# Altium project Temp_sense_Project 2.0.PrjPcb
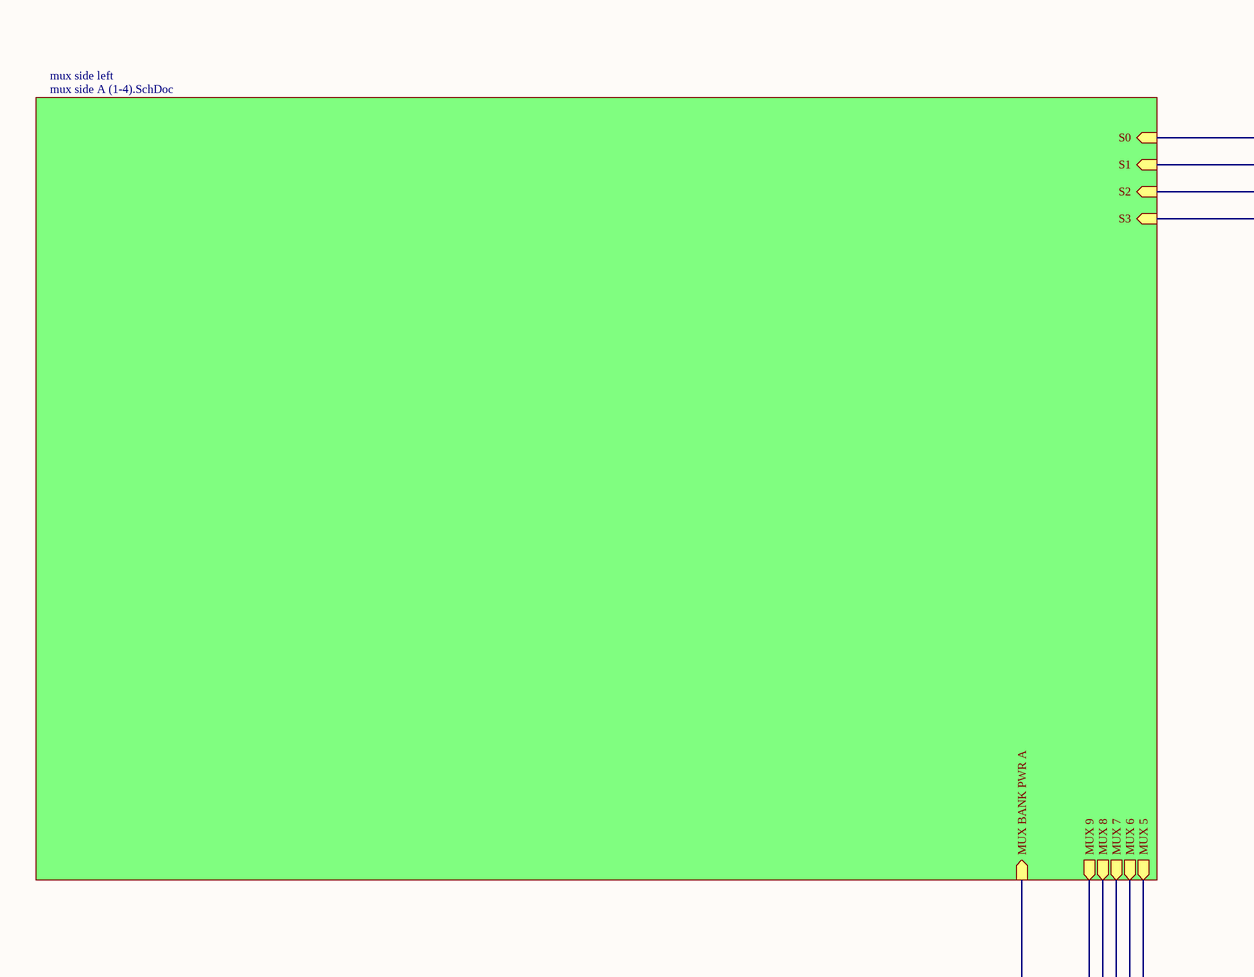
[diagram p0: temp sense 2.0 top.SchDoc, top left]
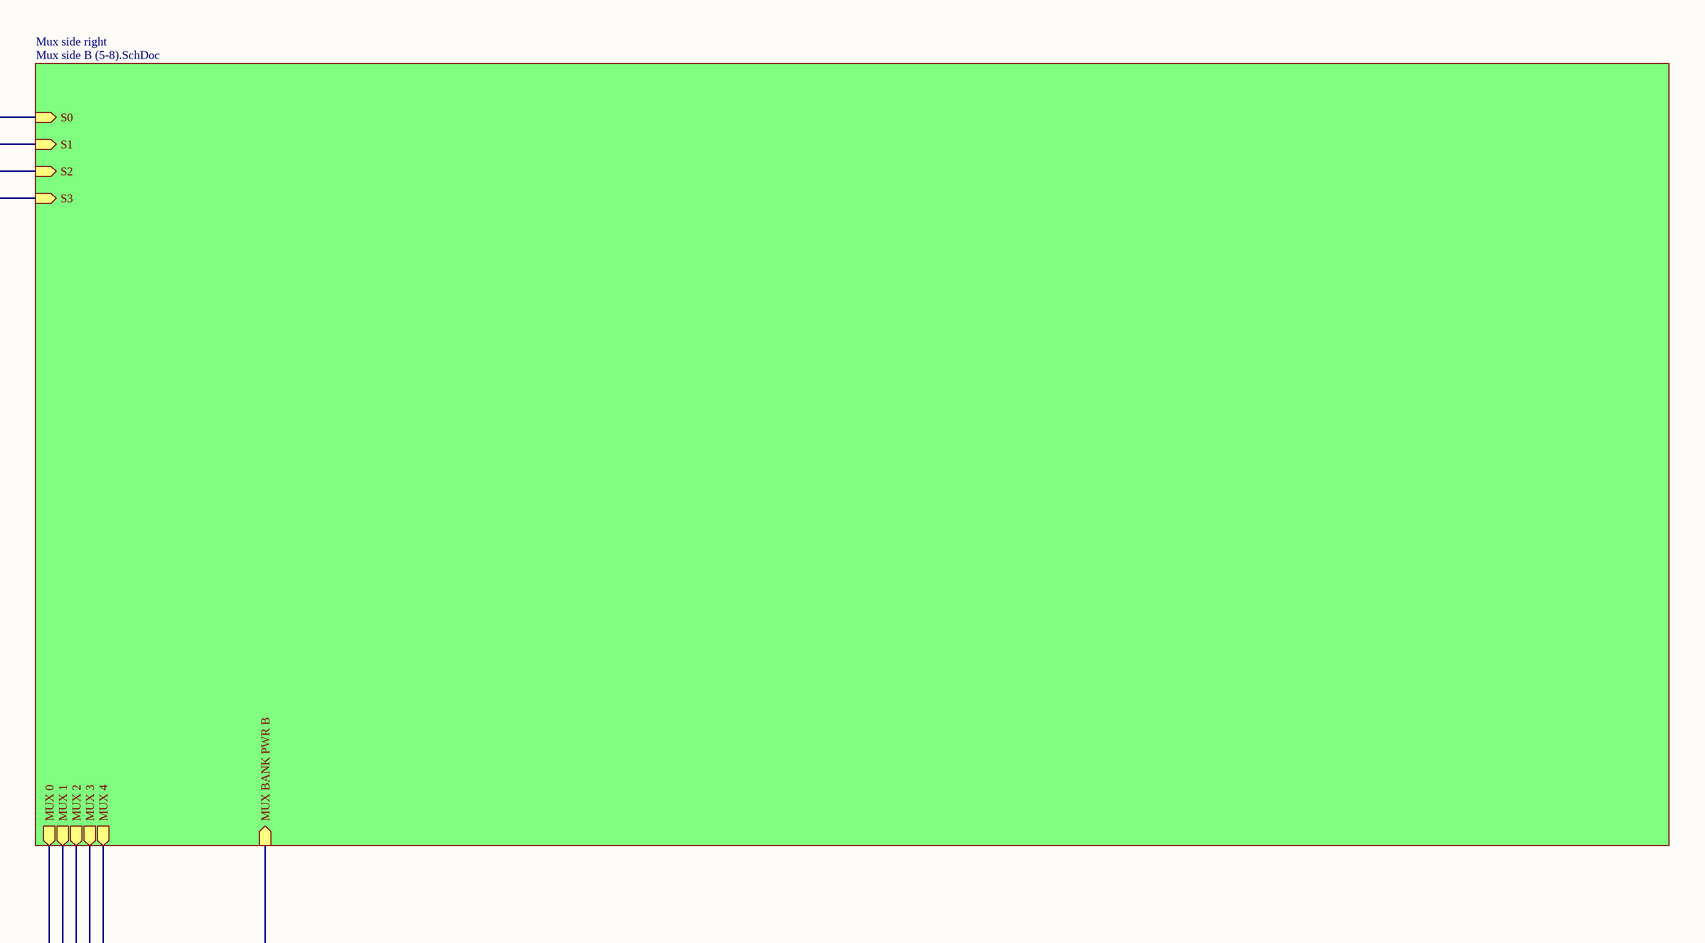
[diagram p1: temp sense 2.0 top.SchDoc, top right]
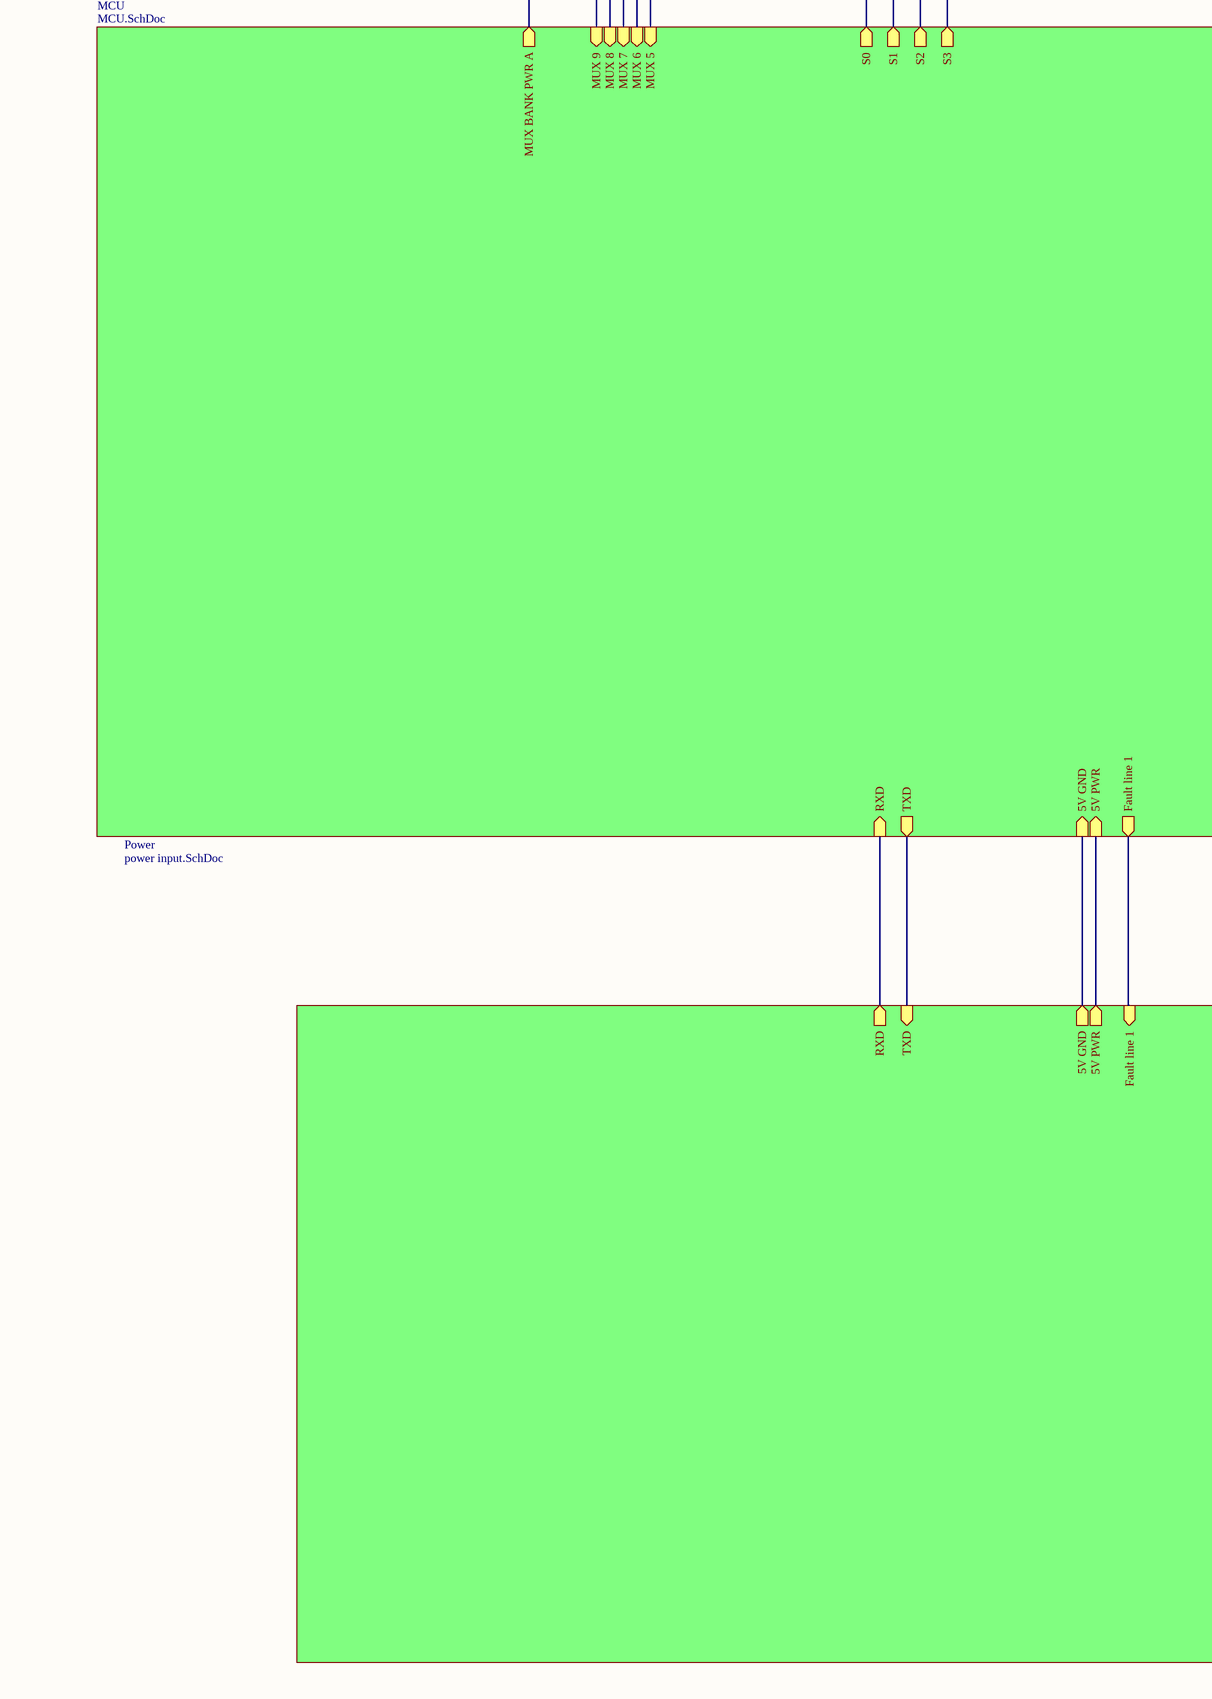
[diagram p2: temp sense 2.0 top.SchDoc, bottom left]
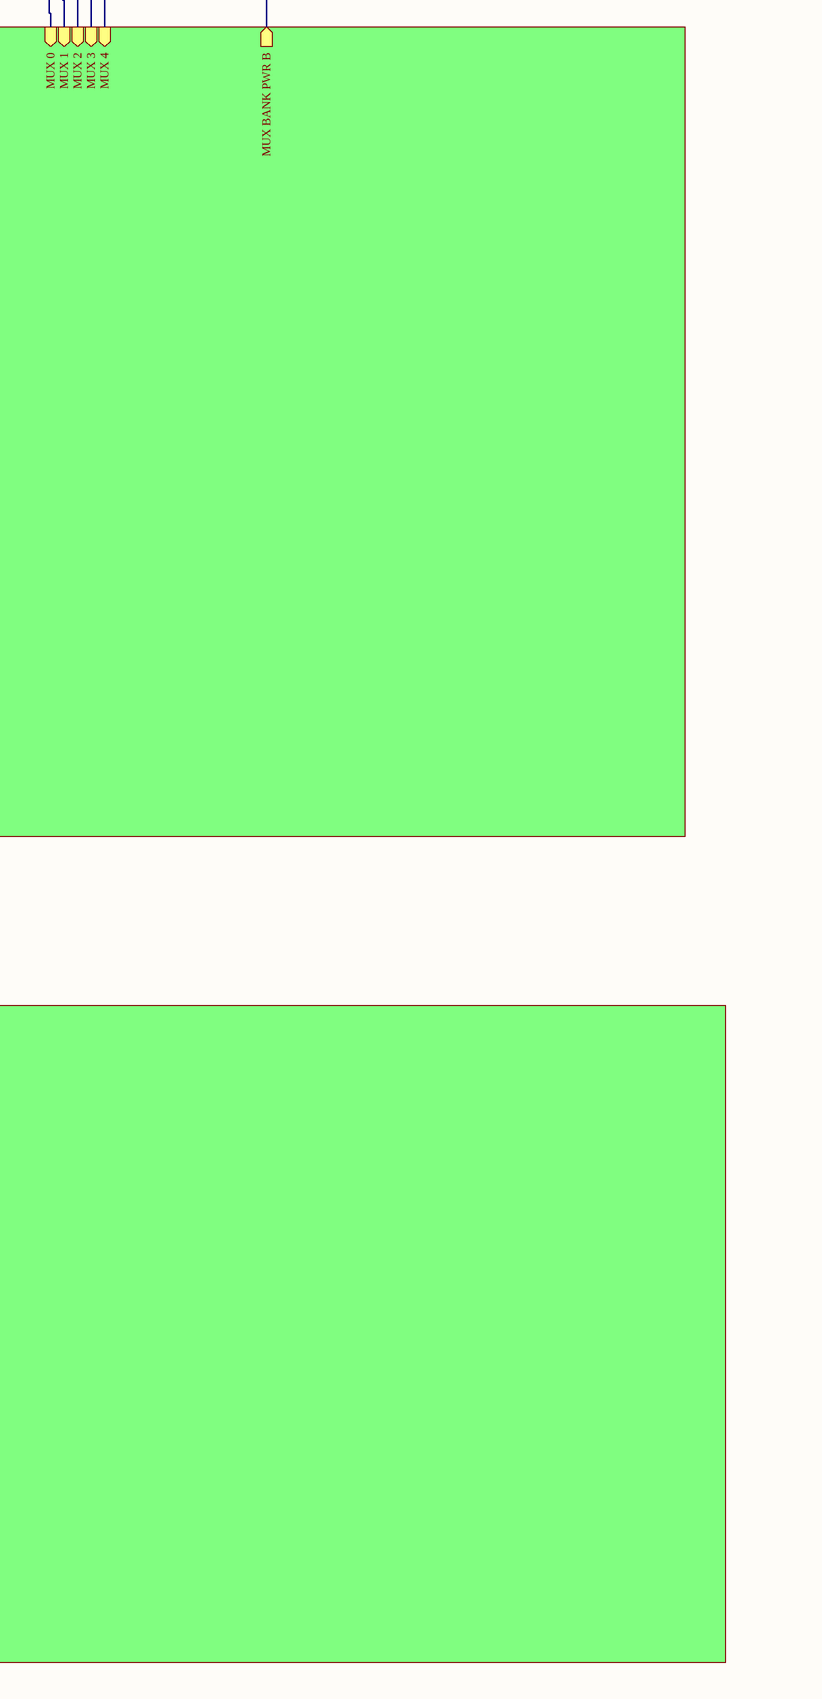
[diagram p3: temp sense 2.0 top.SchDoc, bottom right]
4 sheets, 162 parts. Net scope: hierarchical (ports join the sheet entries above them; power ports are global).
Board files: Temp_sense_Project 2.0(right angle.PcbDoc, temp sense 2.0,uhh.PcbDoc
Sheets:
  temp sense 2.0 top.SchDoc
    Mux side right = Mux side B (5-8).SchDoc
    mux side left = mux side A (1-4).SchDoc
    Power = power input.SchDoc

## Sheet temp sense 2.0 top.SchDoc: 2026 Temp Sense blocks
size 863 x 558 mm; Date: 11/29/2025; Author: Mitchell Donahue; CompanyName: Lawrence Technological University; DrawnBy: Mitchell Donahue; Engineer: Mitchell Donahue; Organization: Blue Devil Motorsport; DocumentNumber: 1; Revision: 1; SheetNumber: 1; SheetTotal: 5; =Project: Temp sense; Application_BuildNumber: 1

### Sub-sheets
MCU = MCU.SchDoc (file not in this document): S0 (out), S1 (out), S2 (out), S3 (out), MUX 0 (in), MUX 1 (in), MUX 2 (in), MUX 3 (in), MUX 4 (in), MUX 5 (in), MUX 6 (in), MUX 7 (in), MUX 8 (in), MUX 9 (in), 5V GND (in), 5V PWR (in), MUX BANK PWR A (out), MUX BANK PWR B (out), TXD (out), RXD (in), Fault line 1 (out)
mux side left = mux side A (1-4).SchDoc: S0 (in), S1 (in), S2 (in), S3 (in), MUX 5 (out), MUX 6 (out), MUX 7 (out), MUX 8 (out), MUX 9 (out), MUX BANK PWR A (in)
Mux side right = Mux side B (5-8).SchDoc: S0 (in), S1 (in), S2 (in), S3 (in), MUX 0 (out), MUX 1 (out), MUX 2 (out), MUX 3 (out), MUX 4 (out), MUX BANK PWR B (in)
Power = power input.SchDoc: 5V GND (out), 5V PWR (out), RXD (out), TXD (in), Fault line 1 (in)

### Nets
GND: sheet Power/5V GND, sheet MCU/5V GND
NetC3_1: sheet mux side left/MUX 5, sheet MCU/MUX 5
NetC4_1: sheet mux side left/MUX 6, sheet MCU/MUX 6
NetC5_1: sheet mux side left/MUX 7, sheet MCU/MUX 7
NetC6_1: sheet mux side left/MUX 8, sheet MCU/MUX 8
NetC7_1: sheet mux side left/MUX 9, sheet MCU/MUX 9
NetC8_1: sheet Mux side right/MUX 0, sheet MCU/MUX 0
NetC9_1: sheet Mux side right/MUX 1, sheet MCU/MUX 1
NetC10_1: sheet Mux side right/MUX 2, sheet MCU/MUX 2
NetC11_1: sheet Mux side right/MUX 3, sheet MCU/MUX 3
NetC12_1: sheet Mux side right/MUX 4, sheet MCU/MUX 4
NetC22_2: sheet Power/5V PWR, sheet MCU/5V PWR
NetR1_1: sheet mux side left/MUX BANK PWR A, sheet MCU/MUX BANK PWR A
NetR61_1: sheet Mux side right/MUX BANK PWR B, sheet MCU/MUX BANK PWR B
NetU1_10: sheet Mux side right/S0, sheet mux side left/S0, sheet MCU/S0
NetU1_11: sheet Mux side right/S1, sheet mux side left/S1, sheet MCU/S1
NetU1_13: sheet Mux side right/S3, sheet mux side left/S3, sheet MCU/S3
NetU1_14: sheet Mux side right/S2, sheet mux side left/S2, sheet MCU/S2
NetU9_11: sheet Power/Fault line 1, sheet MCU/Fault line 1
NetU9_12: sheet Power/TXD, sheet MCU/TXD
NetU9_13: sheet Power/RXD, sheet MCU/RXD

### Notes on the sheet
- DWG. NO.
- REV.
- SHT.
- REVISION
- DESCRIPTION
- DATE
- APPROVED
- THIS DOCUMENT AND THE DATA DISCLOSED HEREIN OR HEREWITH IS THE PROPERTY OF ALTIUM LIMITED AND MAY BE FREELY DISTRIBUTED IN WHOLE. NO RIGHTS ARE RESERVED OR EXPRESS OR IMPLIED WARANTEE GIVEN.
- ENG:
- DSN:
- APPROVALS
- PROJECT
- DOCUMENT REVISION:
- DESIGN ITEM:
- CHK:
- BOM:
- REFERENCE DOCUMENTS
- PROJECT REVISION:
- TITLE
- FAB DWG:
- PCB DWG:
- ASSY DWG:
- SCALE:
- SIZE
- D
- CAGE CODE
- FILE NAME
- DWG NO.
- SHEET
- OF
- REV

## Sheet Mux side B (5-8).SchDoc
size A0; SheetNumber: 3; SheetTotal: 5
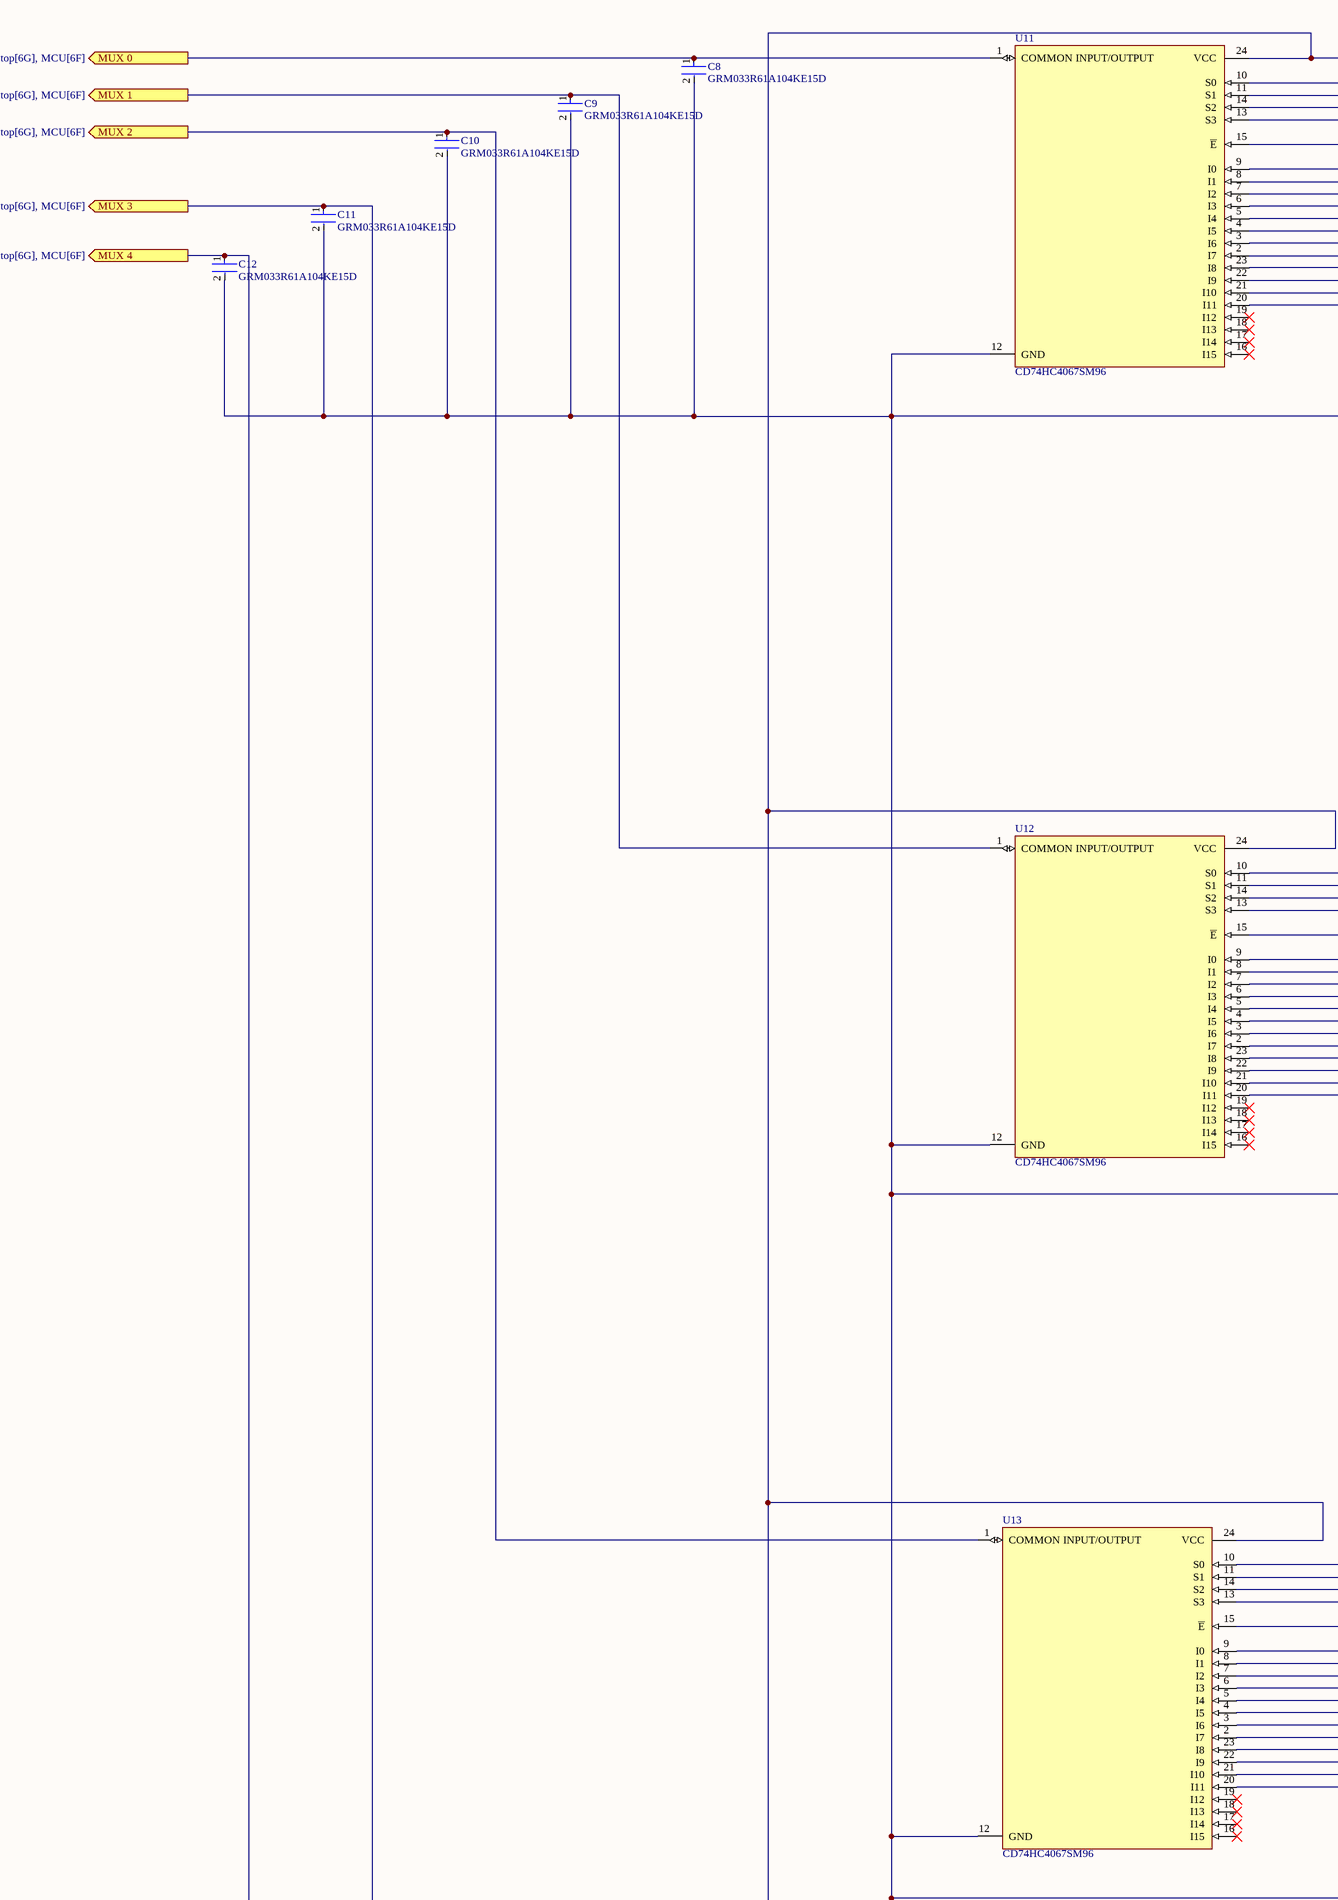
[diagram p4: Mux side B (5-8).SchDoc, top left]
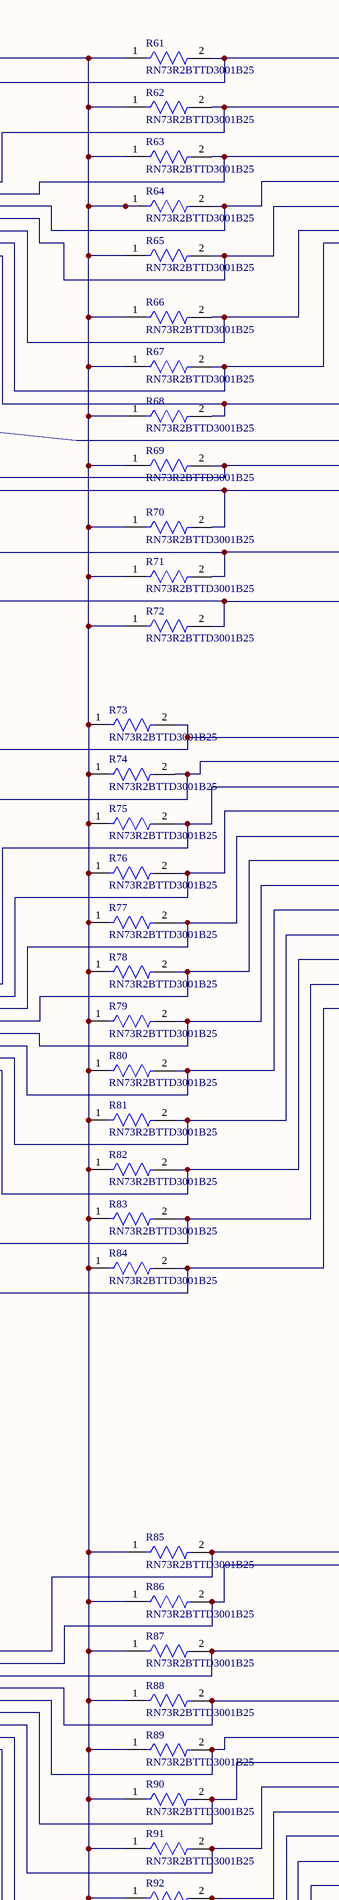
[diagram p5: Mux side B (5-8).SchDoc, top middle]
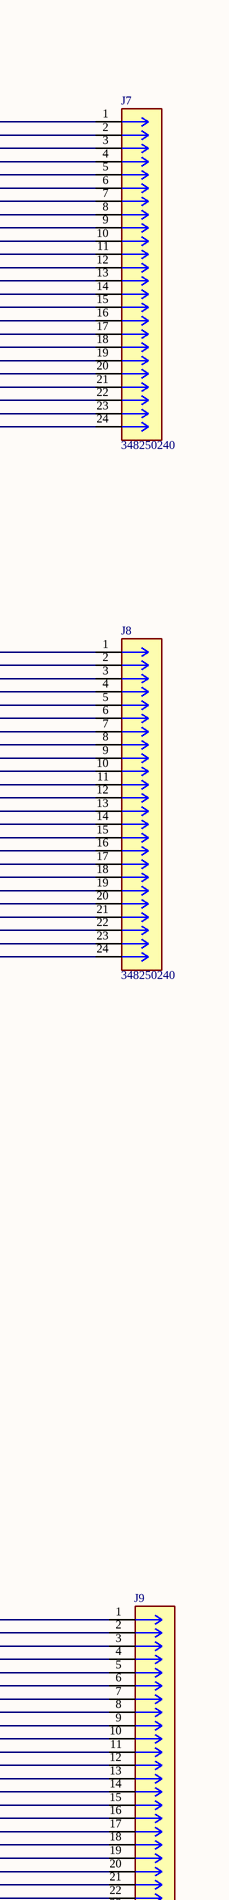
[diagram p6: Mux side B (5-8).SchDoc, top right]
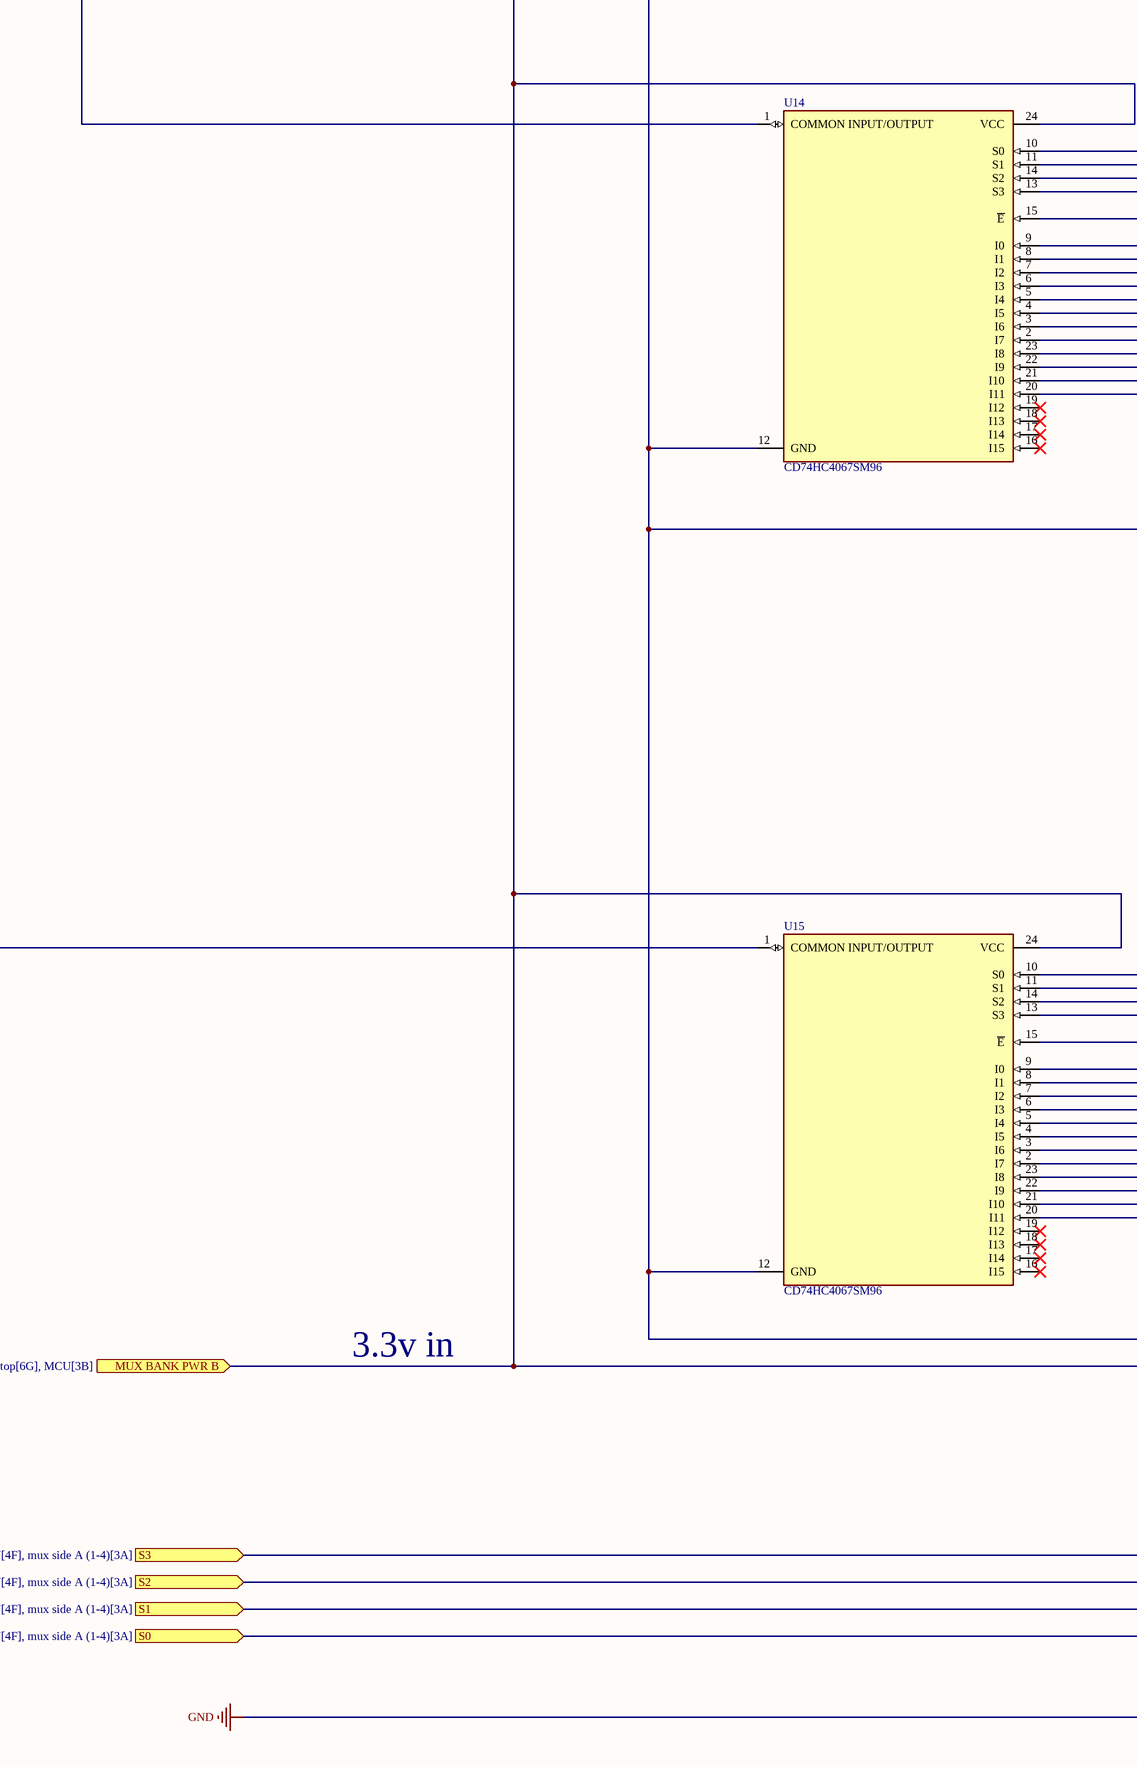
[diagram p7: Mux side B (5-8).SchDoc, bottom left]
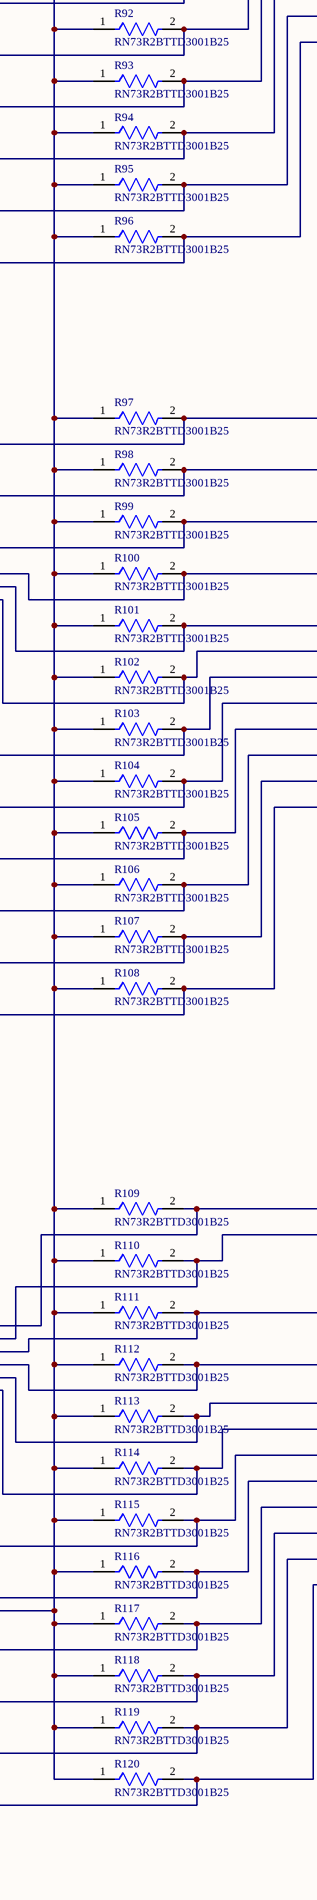
[diagram p8: Mux side B (5-8).SchDoc, bottom middle]
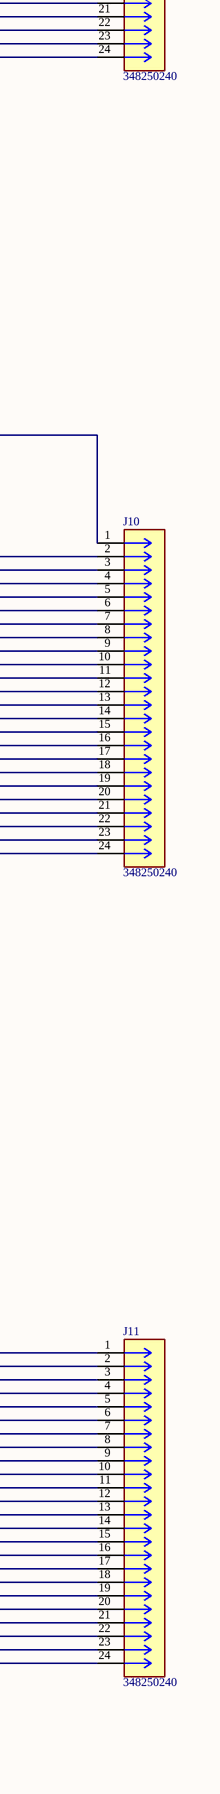
[diagram p9: Mux side B (5-8).SchDoc, bottom right]

### Parts
C8  GRM033R61A104KE15D  [FP-GRM033-0_03-IPC_C]
C9  GRM033R61A104KE15D  [FP-GRM033-0_03-IPC_C]
C10  GRM033R61A104KE15D  [FP-GRM033-0_03-IPC_C]
C11  GRM033R61A104KE15D  [FP-GRM033-0_03-IPC_C]
C12  GRM033R61A104KE15D  [FP-GRM033-0_03-IPC_C]
J7  348250240  [CONN_SD-34825-001_24_MOL]
J8  348250240  [CONN_SD-34825-001_24_MOL]
J9  348250240  [CONN_SD-34825-001_24_MOL]
J10  348250240  [CONN_SD-34825-001_24_MOL]
J11  348250240  [CONN_SD-34825-001_24_MOL]
R61  RN73R2BTTD3001B25  [FP-RN73R2B-IPC_A]
R62  RN73R2BTTD3001B25  [FP-RN73R2B-IPC_A]
R63  RN73R2BTTD3001B25  [FP-RN73R2B-IPC_A]
R64  RN73R2BTTD3001B25  [FP-RN73R2B-IPC_A]
R65  RN73R2BTTD3001B25  [FP-RN73R2B-IPC_A]
R66  RN73R2BTTD3001B25  [FP-RN73R2B-IPC_A]
R67  RN73R2BTTD3001B25  [FP-RN73R2B-IPC_A]
R68  RN73R2BTTD3001B25  [FP-RN73R2B-IPC_A]
R69  RN73R2BTTD3001B25  [FP-RN73R2B-IPC_A]
R70  RN73R2BTTD3001B25  [FP-RN73R2B-IPC_A]
R71  RN73R2BTTD3001B25  [FP-RN73R2B-IPC_A]
R72  RN73R2BTTD3001B25  [FP-RN73R2B-IPC_A]
R73  RN73R2BTTD3001B25  [FP-RN73R2B-IPC_A]
R74  RN73R2BTTD3001B25  [FP-RN73R2B-IPC_A]
R75  RN73R2BTTD3001B25  [FP-RN73R2B-IPC_A]
R76  RN73R2BTTD3001B25  [FP-RN73R2B-IPC_A]
R77  RN73R2BTTD3001B25  [FP-RN73R2B-IPC_A]
R78  RN73R2BTTD3001B25  [FP-RN73R2B-IPC_A]
R79  RN73R2BTTD3001B25  [FP-RN73R2B-IPC_A]
R80  RN73R2BTTD3001B25  [FP-RN73R2B-IPC_A]
R81  RN73R2BTTD3001B25  [FP-RN73R2B-IPC_A]
R82  RN73R2BTTD3001B25  [FP-RN73R2B-IPC_A]
R83  RN73R2BTTD3001B25  [FP-RN73R2B-IPC_A]
R84  RN73R2BTTD3001B25  [FP-RN73R2B-IPC_A]
R85  RN73R2BTTD3001B25  [FP-RN73R2B-IPC_A]
R86  RN73R2BTTD3001B25  [FP-RN73R2B-IPC_A]
R87  RN73R2BTTD3001B25  [FP-RN73R2B-IPC_A]
R88  RN73R2BTTD3001B25  [FP-RN73R2B-IPC_A]
R89  RN73R2BTTD3001B25  [FP-RN73R2B-IPC_A]
R90  RN73R2BTTD3001B25  [FP-RN73R2B-IPC_A]
R91  RN73R2BTTD3001B25  [FP-RN73R2B-IPC_A]
R92  RN73R2BTTD3001B25  [FP-RN73R2B-IPC_A]
R93  RN73R2BTTD3001B25  [FP-RN73R2B-IPC_A]
R94  RN73R2BTTD3001B25  [FP-RN73R2B-IPC_A]
R95  RN73R2BTTD3001B25  [FP-RN73R2B-IPC_A]
R96  RN73R2BTTD3001B25  [FP-RN73R2B-IPC_A]
R97  RN73R2BTTD3001B25  [FP-RN73R2B-IPC_A]
R98  RN73R2BTTD3001B25  [FP-RN73R2B-IPC_A]
R99  RN73R2BTTD3001B25  [FP-RN73R2B-IPC_A]
R100  RN73R2BTTD3001B25  [FP-RN73R2B-IPC_A]
R101  RN73R2BTTD3001B25  [FP-RN73R2B-IPC_A]
R102  RN73R2BTTD3001B25  [FP-RN73R2B-IPC_A]
R103  RN73R2BTTD3001B25  [FP-RN73R2B-IPC_A]
R104  RN73R2BTTD3001B25  [FP-RN73R2B-IPC_A]
R105  RN73R2BTTD3001B25  [FP-RN73R2B-IPC_A]
R106  RN73R2BTTD3001B25  [FP-RN73R2B-IPC_A]
R107  RN73R2BTTD3001B25  [FP-RN73R2B-IPC_A]
R108  RN73R2BTTD3001B25  [FP-RN73R2B-IPC_A]
R109  RN73R2BTTD3001B25  [FP-RN73R2B-IPC_A]
R110  RN73R2BTTD3001B25  [FP-RN73R2B-IPC_A]
R111  RN73R2BTTD3001B25  [FP-RN73R2B-IPC_A]
R112  RN73R2BTTD3001B25  [FP-RN73R2B-IPC_A]
R113  RN73R2BTTD3001B25  [FP-RN73R2B-IPC_A]
R114  RN73R2BTTD3001B25  [FP-RN73R2B-IPC_A]
R115  RN73R2BTTD3001B25  [FP-RN73R2B-IPC_A]
R116  RN73R2BTTD3001B25  [FP-RN73R2B-IPC_A]
R117  RN73R2BTTD3001B25  [FP-RN73R2B-IPC_A]
R118  RN73R2BTTD3001B25  [FP-RN73R2B-IPC_A]
R119  RN73R2BTTD3001B25  [FP-RN73R2B-IPC_A]
R120  RN73R2BTTD3001B25  [FP-RN73R2B-IPC_A]
U11  CD74HC4067SM96  [FP-DB0024A-IPC_C]
U12  CD74HC4067SM96  [FP-DB0024A-IPC_C]
U13  CD74HC4067SM96  [FP-DB0024A-IPC_C]
U14  CD74HC4067SM96  [FP-DB0024A-IPC_C]
U15  CD74HC4067SM96  [FP-DB0024A-IPC_C]

### Ports
MUX 0 (out, see temp sense 2.0 top[6G], MCU[6F]), MUX 1 (out, see temp sense 2.0 top[6G], MCU[6F]), MUX 2 (out, see temp sense 2.0 top[6G], MCU[6F]), MUX 3 (out, see temp sense 2.0 top[6G], MCU[6F]), MUX 4 (out, see temp sense 2.0 top[6G], MCU[6F]), MUX BANK PWR B (in, see temp sense 2.0 top[6G], MCU[3B]), S0 (in, see temp sense 2.0 top[6J], MCU[4F], mux side A (1-4)[3A]), S1 (in, see temp sense 2.0 top[6J], MCU[4F], mux side A (1-4)[3A]), S2 (in, see temp sense 2.0 top[6J], MCU[4F], mux side A (1-4)[3A]), S3 (in, see temp sense 2.0 top[6J], MCU[4F], mux side A (1-4)[3A])

### Nets
GND: C8.2 C9.2 C10.2 C11.2 C12.2 J7.2 J7.4 J7.6 J7.8 J7.10 J7.12 J7.14 J7.16 J7.18 J7.20 J7.22 J7.24 J8.2 J8.4 J8.6 J8.8 J8.10 J8.12 J8.14 J8.16 J8.18 J8.20 J8.22 J8.24 J9.2 J9.4 J9.6 J9.8 J9.10 J9.12 J9.14 J9.16 J9.18 J9.20 J9.22 J9.24 J10.2 J10.4 J10.6 J10.8 J10.10 J10.12 J10.14 J10.16 J10.18 J10.20 J10.22 J10.24 J11.2 J11.4 J11.6 J11.8 J11.10 J11.12 J11.14 J11.16 J11.18 J11.20 J11.22 J11.24 U11.12(GND) U11.15(~{E}) U12.12(GND) U12.15(~{E}) U13.12(GND) U13.15(~{E}) U14.12(GND) U14.15(~{E}) U15.12(GND) U15.15(~{E})
NetC8_1: C8.1 U11.1(COMMON_INPUT/OUTPUT) ; port MUX 0
NetC9_1: C9.1 U12.1(COMMON_INPUT/OUTPUT) ; port MUX 1
NetC10_1: C10.1 U13.1(COMMON_INPUT/OUTPUT) ; port MUX 2
NetC11_1: C11.1 U14.1(COMMON_INPUT/OUTPUT) ; port MUX 3
NetC12_1: C12.1 U15.1(COMMON_INPUT/OUTPUT) ; port MUX 4
NetJ7_1: J7.1 R61.2 U11.9(I0)
NetJ7_3: J7.3 R62.2 U11.8(I1)
NetJ7_5: J7.5 R63.2 U11.7(I2)
NetJ7_7: J7.7 R64.2 U11.6(I3)
NetJ7_9: J7.9 R65.2 U11.5(I4)
NetJ7_11: J7.11 R66.2 U11.4(I5)
NetJ7_13: J7.13 R67.2 U11.3(I6)
NetJ7_15: J7.15 R68.2 U11.2(I7)
NetJ7_17: J7.17 R69.2 U11.23(I8)
NetJ7_19: J7.19 R70.2 U11.22(I9)
NetJ7_21: J7.21 R71.2 U11.21(I10)
NetJ7_23: J7.23 R72.2 U11.20(I11)
NetJ8_1: J8.1 R73.2 U12.9(I0)
NetJ8_3: J8.3 R74.2 U12.8(I1)
NetJ8_5: J8.5 R75.2 U12.7(I2)
NetJ8_7: J8.7 R76.2 U12.6(I3)
NetJ8_9: J8.9 R77.2 U12.5(I4)
NetJ8_11: J8.11 R78.2 U12.4(I5)
NetJ8_13: J8.13 R79.2 U12.3(I6)
NetJ8_15: J8.15 R80.2 U12.2(I7)
NetJ8_17: J8.17 R81.2 U12.23(I8)
NetJ8_19: J8.19 R82.2 U12.22(I9)
NetJ8_21: J8.21 R83.2 U12.21(I10)
NetJ8_23: J8.23 R84.2 U12.20(I11)
NetJ9_1: J9.1 R85.2 U13.9(I0)
NetJ9_3: J9.3 R86.2 U13.8(I1)
NetJ9_5: J9.5 R87.2 U13.7(I2)
NetJ9_7: J9.7 R88.2 U13.6(I3)
NetJ9_9: J9.9 R89.2 U13.5(I4)
NetJ9_11: J9.11 R90.2 U13.4(I5)
NetJ9_13: J9.13 R91.2 U13.3(I6)
NetJ9_15: J9.15 R92.2 U13.2(I7)
NetJ9_17: J9.17 R93.2 U13.23(I8)
NetJ9_19: J9.19 R94.2 U13.22(I9)
NetJ9_21: J9.21 R95.2 U13.21(I10)
NetJ9_23: J9.23 R96.2 U13.20(I11)
NetJ10_1: J10.1 R97.2 U14.9(I0)
NetJ10_3: J10.3 R98.2 U14.8(I1)
NetJ10_5: J10.5 R99.2 U14.7(I2)
NetJ10_7: J10.7 R100.2 U14.6(I3)
NetJ10_9: J10.9 R101.2 U14.5(I4)
NetJ10_11: J10.11 R102.2 U14.4(I5)
NetJ10_13: J10.13 R103.2 U14.3(I6)
NetJ10_15: J10.15 R104.2 U14.2(I7)
NetJ10_17: J10.17 R105.2 U14.23(I8)
NetJ10_19: J10.19 R106.2 U14.22(I9)
NetJ10_21: J10.21 R107.2 U14.21(I10)
NetJ10_23: J10.23 R108.2 U14.20(I11)
NetJ11_1: J11.1 R109.2 U15.9(I0)
NetJ11_3: J11.3 R110.2 U15.8(I1)
NetJ11_5: J11.5 R111.2 U15.7(I2)
NetJ11_7: J11.7 R112.2 U15.6(I3)
NetJ11_9: J11.9 R113.2 U15.5(I4)
NetJ11_11: J11.11 R114.2 U15.4(I5)
NetJ11_13: J11.13 R115.2 U15.3(I6)
NetJ11_15: J11.15 R116.2 U15.2(I7)
NetJ11_17: J11.17 R117.2 U15.23(I8)
NetJ11_19: J11.19 R118.2 U15.22(I9)
NetJ11_21: J11.21 R119.2 U15.21(I10)
NetJ11_23: J11.23 R120.2 U15.20(I11)
NetR61_1: R61.1 R62.1 R63.1 R64.1 R65.1 R66.1 R67.1 R68.1 R69.1 R70.1 R71.1 R72.1 R73.1 R74.1 R75.1 R76.1 R77.1 R78.1 R79.1 R80.1 R81.1 R82.1 R83.1 R84.1 R85.1 R86.1 R87.1 R88.1 R89.1 R90.1 R91.1 R92.1 R93.1 R94.1 R95.1 R96.1 R97.1 R98.1 R99.1 R100.1 R101.1 R102.1 R103.1 R104.1 R105.1 R106.1 R107.1 R108.1 R109.1 R110.1 R111.1 R112.1 R113.1 R114.1 R115.1 R116.1 R117.1 R118.1 R119.1 R120.1 U11.24(VCC) U12.24(VCC) U13.24(VCC) U14.24(VCC) U15.24(VCC) ; port MUX BANK PWR B
NetU1_10: U11.10(S0) U12.10(S0) U13.10(S0) U14.10(S0) U15.10(S0) ; port S0
NetU1_11: U11.11(S1) U12.11(S1) U13.11(S1) U14.11(S1) U15.11(S1) ; port S1
NetU1_13: U11.13(S3) U12.13(S3) U13.13(S3) U14.13(S3) U15.13(S3) ; port S3
NetU1_14: U11.14(S2) U12.14(S2) U13.14(S2) U14.14(S2) U15.14(S2) ; port S2

Not connected (* = marked no-connect by the designer): U11 16(I15)* 17(I14)* 18(I13)* 19(I12)*; U12 16(I15)* 17(I14)* 18(I13)* 19(I12)*; U13 16(I15)* 17(I14)* 18(I13)* 19(I12)*; U14 16(I15)* 17(I14)* 18(I13)* 19(I12)*; U15 16(I15)* 17(I14)* 18(I13)* 19(I12)*

### Notes on the sheet
- 3.3v in

### Library data of the parts
C8-C12 = CMP-2010-01264-2: Chip Multilayer Ceramic Capacitors for General Purpose, 0201, 0.10uF, X5R, 15%, 10%, 10V; Capacitance: 100nF; Mount: Surface Mount; Dielectric: X5R; Width: 0.012inch; Tolerance: 10%; Radiation Hardening: No; Voltage Rating: 10V; REACH SVHC: No SVHC; Height: 0.3mm; Max Operating Temperature: 85°C; Voltage Rating (DC): 10V; Thickness: 0.013inch; Termination: SMD/SMT; Lead Free: Lead Free; Package Quantity: 1; Case/Package: 0201; Min Operating Temperature: -55°C; Weight: 6E-06oz; Length: 0.6mm; Case Code (Imperial): 0201; Depth: 0.3mm; Voltage: 10V; Packaging: Tape and Reel; Case Code (Metric): 0603
R61-R120 = CMP-04015-056270-1: 3kΩ ±0.1% 0.25W, 1/4W Chip Resistor 1206 (3216 Metric) Moisture Resistant Thin Film
U11-U15 = CMP-04892-000038-1: IC MUX/DEMUX 1X16 24SSOP; Supply Type: Single; High Level Output Current: 25mA; Min Supply Voltage: 2V; Number of Circuits: 16; Max Supply Voltage: 6V; Number of Channels: 1; Turn-On Delay Time: 300ns; Max Supply Current: 8uA; Bandwidth: 89MHz; Turn-Off Delay Time: 290ns; Propagation Delay: 75ns; Logic Function: Multiplexer; On-State Resistance: 160R; Polarity: Non-Inverting; Width: 5.3mm; Case/Package: SSOP; Max Operating Temperature: 125°C; Mount: Surface Mount; Min Operating Temperature: -55°C; REACH SVHC: No SVHC; Contact Plating: Gold; Max Output Current: 25mA; Weight: 0.006081oz; Height: 1.95mm; Package Quantity: 2000; Length: 8.2mm; Lead Free: Lead Free; Operating Supply Current: 8uA; Packaging: Tape and Reel; Series: 74HC; Low Level Output Current: 25mA; Number of Outputs: 1; Termination: SMD/SMT; Number of Inputs: 16; Number of Bits: 16; Radiation Hardening: No; Number of Pins: 24
J7-J11 = 348250240: Package: None; Price: None; Value: *; MP: 348250240; Availability: Unavailable
  J9: ComponentLink1Description: New link; ComponentLink1URL: *; ComponentLink2Description: New link 1; ComponentLink2URL: *

## Sheet mux side A (1-4).SchDoc
size E; SheetNumber: 2; SheetTotal: 4
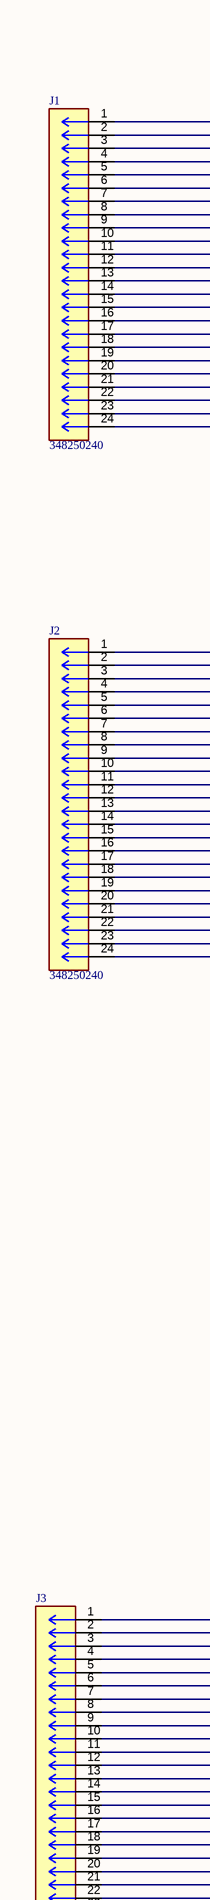
[diagram p10: mux side A (1-4).SchDoc, top left]
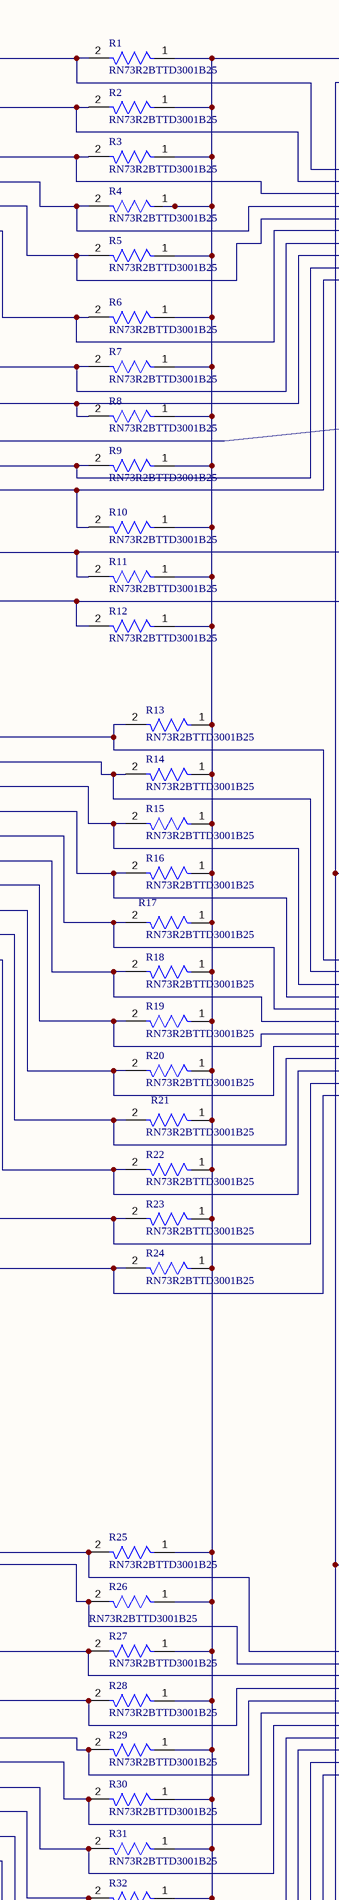
[diagram p11: mux side A (1-4).SchDoc, top middle]
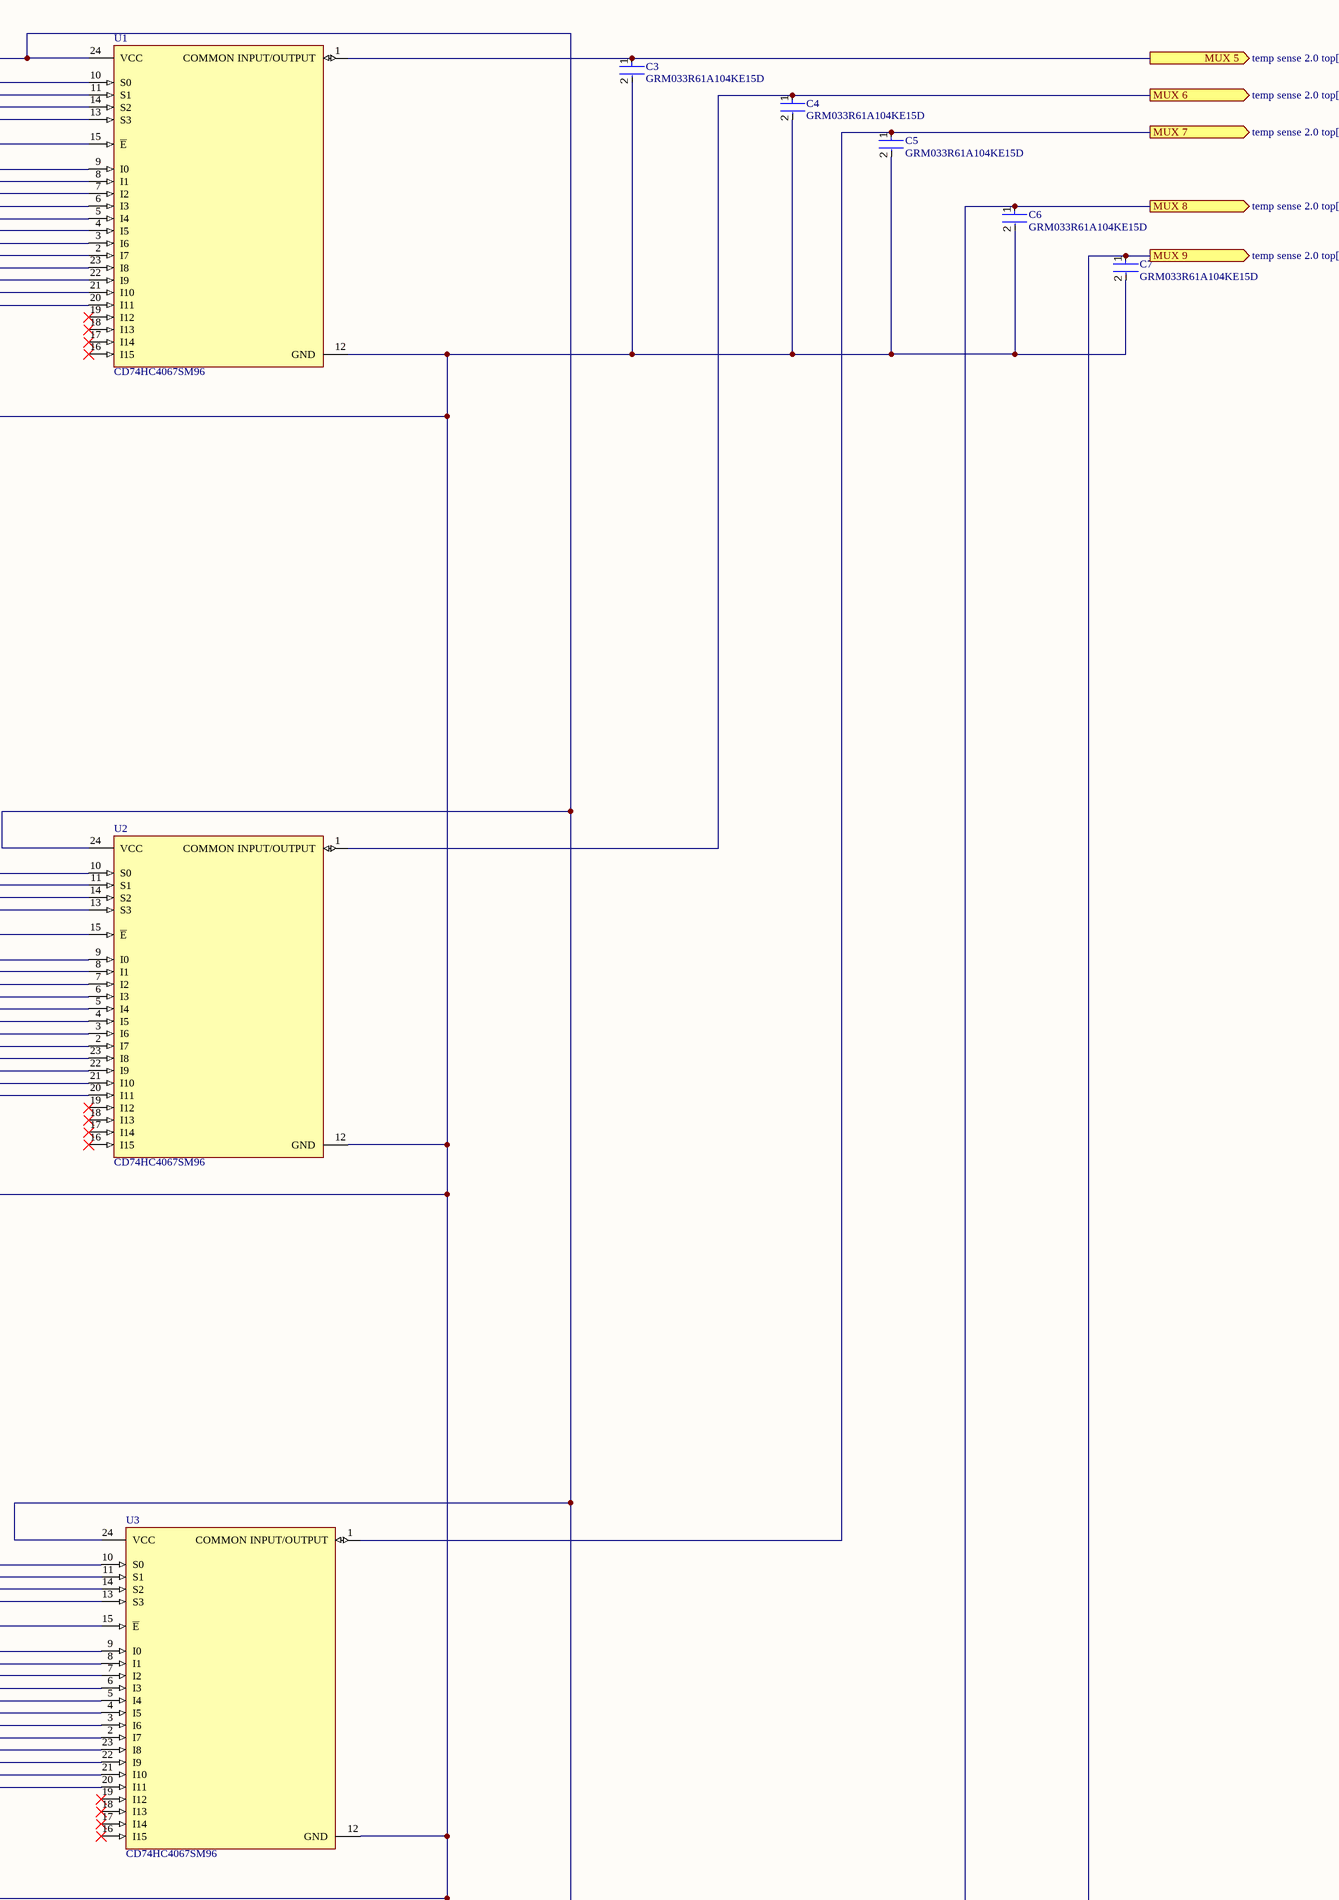
[diagram p12: mux side A (1-4).SchDoc, top right]
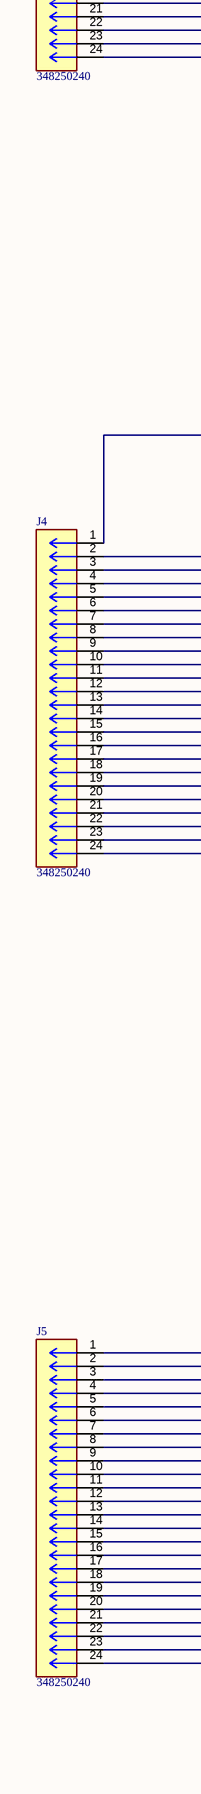
[diagram p13: mux side A (1-4).SchDoc, bottom left]
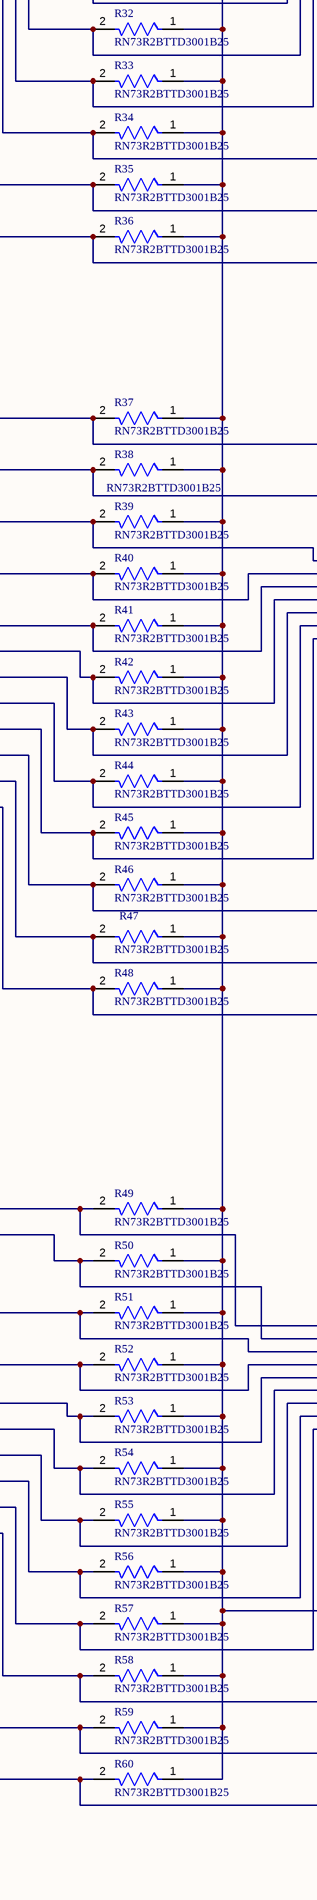
[diagram p14: mux side A (1-4).SchDoc, bottom middle]
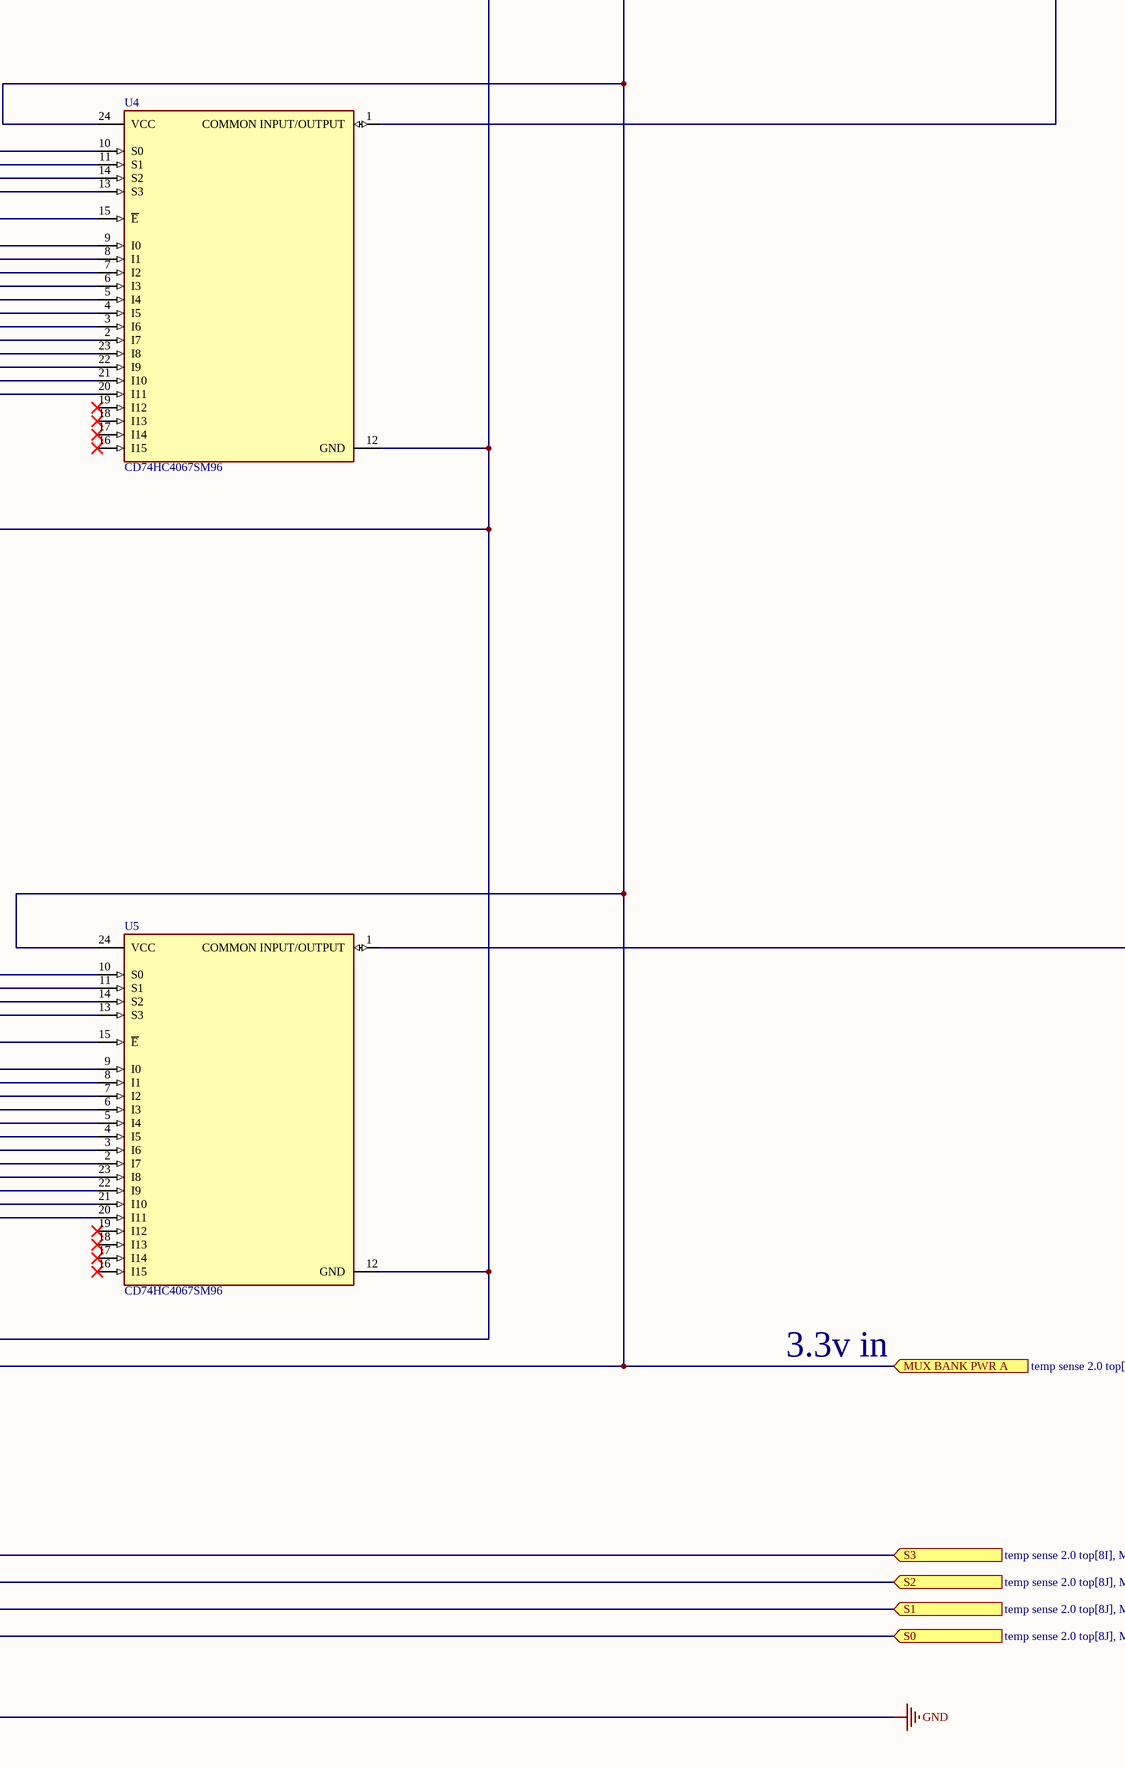
[diagram p15: mux side A (1-4).SchDoc, bottom right]

### Parts
C3  GRM033R61A104KE15D  [FP-GRM033-0_03-IPC_C]
C4  GRM033R61A104KE15D  [FP-GRM033-0_03-IPC_C]
C5  GRM033R61A104KE15D  [FP-GRM033-0_03-IPC_C]
C6  GRM033R61A104KE15D  [FP-GRM033-0_03-IPC_C]
C7  GRM033R61A104KE15D  [FP-GRM033-0_03-IPC_C]
J1  348250240  [CONN_SD-34825-001_24_MOL]
J2  348250240  [CONN_SD-34825-001_24_MOL]
J3  348250240  [CONN_SD-34825-001_24_MOL]
J4  348250240  [CONN_SD-34825-001_24_MOL]
J5  348250240  [CONN_SD-34825-001_24_MOL]
R1  RN73R2BTTD3001B25  [FP-RN73R2B-IPC_A]
R2  RN73R2BTTD3001B25  [FP-RN73R2B-IPC_A]
R3  RN73R2BTTD3001B25  [FP-RN73R2B-IPC_A]
R4  RN73R2BTTD3001B25  [FP-RN73R2B-IPC_A]
R5  RN73R2BTTD3001B25  [FP-RN73R2B-IPC_A]
R6  RN73R2BTTD3001B25  [FP-RN73R2B-IPC_A]
R7  RN73R2BTTD3001B25  [FP-RN73R2B-IPC_A]
R8  RN73R2BTTD3001B25  [FP-RN73R2B-IPC_A]
R9  RN73R2BTTD3001B25  [FP-RN73R2B-IPC_A]
R10  RN73R2BTTD3001B25  [FP-RN73R2B-IPC_A]
R11  RN73R2BTTD3001B25  [FP-RN73R2B-IPC_A]
R12  RN73R2BTTD3001B25  [FP-RN73R2B-IPC_A]
R13  RN73R2BTTD3001B25  [FP-RN73R2B-IPC_A]
R14  RN73R2BTTD3001B25  [FP-RN73R2B-IPC_A]
R15  RN73R2BTTD3001B25  [FP-RN73R2B-IPC_A]
R16  RN73R2BTTD3001B25  [FP-RN73R2B-IPC_A]
R17  RN73R2BTTD3001B25  [FP-RN73R2B-IPC_A]
R18  RN73R2BTTD3001B25  [FP-RN73R2B-IPC_A]
R19  RN73R2BTTD3001B25  [FP-RN73R2B-IPC_A]
R20  RN73R2BTTD3001B25  [FP-RN73R2B-IPC_A]
R21  RN73R2BTTD3001B25  [FP-RN73R2B-IPC_A]
R22  RN73R2BTTD3001B25  [FP-RN73R2B-IPC_A]
R23  RN73R2BTTD3001B25  [FP-RN73R2B-IPC_A]
R24  RN73R2BTTD3001B25  [FP-RN73R2B-IPC_A]
R25  RN73R2BTTD3001B25  [FP-RN73R2B-IPC_A]
R26  RN73R2BTTD3001B25  [FP-RN73R2B-IPC_A]
R27  RN73R2BTTD3001B25  [FP-RN73R2B-IPC_A]
R28  RN73R2BTTD3001B25  [FP-RN73R2B-IPC_A]
R29  RN73R2BTTD3001B25  [FP-RN73R2B-IPC_A]
R30  RN73R2BTTD3001B25  [FP-RN73R2B-IPC_A]
R31  RN73R2BTTD3001B25  [FP-RN73R2B-IPC_A]
R32  RN73R2BTTD3001B25  [FP-RN73R2B-IPC_A]
R33  RN73R2BTTD3001B25  [FP-RN73R2B-IPC_A]
R34  RN73R2BTTD3001B25  [FP-RN73R2B-IPC_A]
R35  RN73R2BTTD3001B25  [FP-RN73R2B-IPC_A]
R36  RN73R2BTTD3001B25  [FP-RN73R2B-IPC_A]
R37  RN73R2BTTD3001B25  [FP-RN73R2B-IPC_A]
R38  RN73R2BTTD3001B25  [FP-RN73R2B-IPC_A]
R39  RN73R2BTTD3001B25  [FP-RN73R2B-IPC_A]
R40  RN73R2BTTD3001B25  [FP-RN73R2B-IPC_A]
R41  RN73R2BTTD3001B25  [FP-RN73R2B-IPC_A]
R42  RN73R2BTTD3001B25  [FP-RN73R2B-IPC_A]
R43  RN73R2BTTD3001B25  [FP-RN73R2B-IPC_A]
R44  RN73R2BTTD3001B25  [FP-RN73R2B-IPC_A]
R45  RN73R2BTTD3001B25  [FP-RN73R2B-IPC_A]
R46  RN73R2BTTD3001B25  [FP-RN73R2B-IPC_A]
R47  RN73R2BTTD3001B25  [FP-RN73R2B-IPC_A]
R48  RN73R2BTTD3001B25  [FP-RN73R2B-IPC_A]
R49  RN73R2BTTD3001B25  [FP-RN73R2B-IPC_A]
R50  RN73R2BTTD3001B25  [FP-RN73R2B-IPC_A]
R51  RN73R2BTTD3001B25  [FP-RN73R2B-IPC_A]
R52  RN73R2BTTD3001B25  [FP-RN73R2B-IPC_A]
R53  RN73R2BTTD3001B25  [FP-RN73R2B-IPC_A]
R54  RN73R2BTTD3001B25  [FP-RN73R2B-IPC_A]
R55  RN73R2BTTD3001B25  [FP-RN73R2B-IPC_A]
R56  RN73R2BTTD3001B25  [FP-RN73R2B-IPC_A]
R57  RN73R2BTTD3001B25  [FP-RN73R2B-IPC_A]
R58  RN73R2BTTD3001B25  [FP-RN73R2B-IPC_A]
R59  RN73R2BTTD3001B25  [FP-RN73R2B-IPC_A]
R60  RN73R2BTTD3001B25  [FP-RN73R2B-IPC_A]
U1  CD74HC4067SM96  [FP-DB0024A-IPC_C]
U2  CD74HC4067SM96  [FP-DB0024A-IPC_C]
U3  CD74HC4067SM96  [FP-DB0024A-IPC_C]
U4  CD74HC4067SM96  [FP-DB0024A-IPC_C]
U5  CD74HC4067SM96  [FP-DB0024A-IPC_C]

### Ports
MUX 5 (out, see temp sense 2.0 top[8G], MCU[6F]), MUX 6 (out, see temp sense 2.0 top[8G], MCU[6F]), MUX 7 (out, see temp sense 2.0 top[8G], MCU[6F]), MUX 8 (out, see temp sense 2.0 top[8G], MCU[6E]), MUX 9 (out, see temp sense 2.0 top[8G], MCU[6E]), MUX BANK PWR A (in, see temp sense 2.0 top[8G], MCU[3C]), S0 (in, see temp sense 2.0 top[8J], MCU[4F], Mux side B (5-8)[3D]), S1 (in, see temp sense 2.0 top[8J], MCU[4F], Mux side B (5-8)[3D]), S2 (in, see temp sense 2.0 top[8J], MCU[4F], Mux side B (5-8)[3D]), S3 (in, see temp sense 2.0 top[8I], MCU[4F], Mux side B (5-8)[3D])

### Nets
GND: C3.2 C4.2 C5.2 C6.2 C7.2 J1.2 J1.4 J1.6 J1.8 J1.10 J1.12 J1.14 J1.16 J1.18 J1.20 J1.22 J1.24 J2.2 J2.4 J2.6 J2.8 J2.10 J2.12 J2.14 J2.16 J2.18 J2.20 J2.22 J2.24 J3.2 J3.4 J3.6 J3.8 J3.10 J3.12 J3.14 J3.16 J3.18 J3.20 J3.22 J3.24 J4.2 J4.4 J4.6 J4.8 J4.10 J4.12 J4.14 J4.16 J4.18 J4.20 J4.22 J4.24 J5.2 J5.4 J5.6 J5.8 J5.10 J5.12 J5.14 J5.16 J5.18 J5.20 J5.22 J5.24 U1.12(GND) U1.15(~{E}) U2.12(GND) U2.15(~{E}) U3.12(GND) U3.15(~{E}) U4.12(GND) U4.15(~{E}) U5.12(GND) U5.15(~{E})
NetC3_1: C3.1 U1.1(COMMON_INPUT/OUTPUT) ; port MUX 5
NetC4_1: C4.1 U2.1(COMMON_INPUT/OUTPUT) ; port MUX 6
NetC5_1: C5.1 U3.1(COMMON_INPUT/OUTPUT) ; port MUX 7
NetC6_1: C6.1 U4.1(COMMON_INPUT/OUTPUT) ; port MUX 8
NetC7_1: C7.1 U5.1(COMMON_INPUT/OUTPUT) ; port MUX 9
NetJ1_1: J1.1 R1.2 U1.9(I0)
NetJ1_3: J1.3 R2.2 U1.8(I1)
NetJ1_5: J1.5 R3.2 U1.7(I2)
NetJ1_7: J1.7 R4.2 U1.6(I3)
NetJ1_9: J1.9 R5.2 U1.5(I4)
NetJ1_11: J1.11 R6.2 U1.4(I5)
NetJ1_13: J1.13 R7.2 U1.3(I6)
NetJ1_15: J1.15 R8.2 U1.2(I7)
NetJ1_17: J1.17 R9.2 U1.23(I8)
NetJ1_19: J1.19 R10.2 U1.22(I9)
NetJ1_21: J1.21 R11.2 U1.21(I10)
NetJ1_23: J1.23 R12.2 U1.20(I11)
NetJ2_1: J2.1 R13.2 U2.9(I0)
NetJ2_3: J2.3 R14.2 U2.8(I1)
NetJ2_5: J2.5 R15.2 U2.7(I2)
NetJ2_7: J2.7 R16.2 U2.6(I3)
NetJ2_9: J2.9 R17.2 U2.5(I4)
NetJ2_11: J2.11 R18.2 U2.4(I5)
NetJ2_13: J2.13 R19.2 U2.3(I6)
NetJ2_15: J2.15 R20.2 U2.2(I7)
NetJ2_17: J2.17 R21.2 U2.23(I8)
NetJ2_19: J2.19 R22.2 U2.22(I9)
NetJ2_21: J2.21 R23.2 U2.21(I10)
NetJ2_23: J2.23 R24.2 U2.20(I11)
NetJ3_1: J3.1 R25.2 U3.9(I0)
NetJ3_3: J3.3 R26.2 U3.8(I1)
NetJ3_5: J3.5 R27.2 U3.7(I2)
NetJ3_7: J3.7 R28.2 U3.6(I3)
NetJ3_9: J3.9 R29.2 U3.5(I4)
NetJ3_11: J3.11 R30.2 U3.4(I5)
NetJ3_13: J3.13 R31.2 U3.3(I6)
NetJ3_15: J3.15 R32.2 U3.2(I7)
NetJ3_17: J3.17 R33.2 U3.23(I8)
NetJ3_19: J3.19 R34.2 U3.22(I9)
NetJ3_21: J3.21 R35.2 U3.21(I10)
NetJ3_23: J3.23 R36.2 U3.20(I11)
NetJ4_1: J4.1 R37.2 U4.9(I0)
NetJ4_3: J4.3 R38.2 U4.8(I1)
NetJ4_5: J4.5 R39.2 U4.7(I2)
NetJ4_7: J4.7 R40.2 U4.6(I3)
NetJ4_9: J4.9 R41.2 U4.5(I4)
NetJ4_11: J4.11 R42.2 U4.4(I5)
NetJ4_13: J4.13 R43.2 U4.3(I6)
NetJ4_15: J4.15 R44.2 U4.2(I7)
NetJ4_17: J4.17 R45.2 U4.23(I8)
NetJ4_19: J4.19 R46.2 U4.22(I9)
NetJ4_21: J4.21 R47.2 U4.21(I10)
NetJ4_23: J4.23 R48.2 U4.20(I11)
NetJ5_1: J5.1 R49.2 U5.9(I0)
NetJ5_3: J5.3 R50.2 U5.8(I1)
NetJ5_5: J5.5 R51.2 U5.7(I2)
NetJ5_7: J5.7 R52.2 U5.6(I3)
NetJ5_9: J5.9 R53.2 U5.5(I4)
NetJ5_11: J5.11 R54.2 U5.4(I5)
NetJ5_13: J5.13 R55.2 U5.3(I6)
NetJ5_15: J5.15 R56.2 U5.2(I7)
NetJ5_17: J5.17 R57.2 U5.23(I8)
NetJ5_19: J5.19 R58.2 U5.22(I9)
NetJ5_21: J5.21 R59.2 U5.21(I10)
NetJ5_23: J5.23 R60.2 U5.20(I11)
NetR1_1: R1.1 R2.1 R3.1 R4.1 R5.1 R6.1 R7.1 R8.1 R9.1 R10.1 R11.1 R12.1 R13.1 R14.1 R15.1 R16.1 R17.1 R18.1 R19.1 R20.1 R21.1 R22.1 R23.1 R24.1 R25.1 R26.1 R27.1 R28.1 R29.1 R30.1 R31.1 R32.1 R33.1 R34.1 R35.1 R36.1 R37.1 R38.1 R39.1 R40.1 R41.1 R42.1 R43.1 R44.1 R45.1 R46.1 R47.1 R48.1 R49.1 R50.1 R51.1 R52.1 R53.1 R54.1 R55.1 R56.1 R57.1 R58.1 R59.1 R60.1 U1.24(VCC) U2.24(VCC) U3.24(VCC) U4.24(VCC) U5.24(VCC) ; port MUX BANK PWR A
NetU1_10: U1.10(S0) U2.10(S0) U3.10(S0) U4.10(S0) U5.10(S0) ; port S0
NetU1_11: U1.11(S1) U2.11(S1) U3.11(S1) U4.11(S1) U5.11(S1) ; port S1
NetU1_13: U1.13(S3) U2.13(S3) U3.13(S3) U4.13(S3) U5.13(S3) ; port S3
NetU1_14: U1.14(S2) U2.14(S2) U3.14(S2) U4.14(S2) U5.14(S2) ; port S2

Not connected (* = marked no-connect by the designer): U1 16(I15)* 17(I14)* 18(I13)* 19(I12)*; U2 16(I15)* 17(I14)* 18(I13)* 19(I12)*; U3 16(I15)* 17(I14)* 18(I13)* 19(I12)*; U4 16(I15)* 17(I14)* 18(I13)* 19(I12)*; U5 16(I15)* 17(I14)* 18(I13)* 19(I12)*

### Notes on the sheet
- 3.3v in
- THIS DOCUMENT AND THE DATA DISCLOSED HEREIN OR
- HEREWITH IS THE PROPERTY OF ALTIUM LIMITED AND MAY
- DWG NO:
- REVISION
- REV:
- DESCRIPTION
- DATE
- APPROVED
- BE FREELY DISTRIBUTED IN WHOLE. NO RIGHTS ARE
- RESERVED OR EXPRESS OR IMPLIED WARANTEE GIVEN.
- ENG:
- APPROVALS
- PROJECT
- DSN:
- CHK:
- REFERENCE DOCUMENTS
- PROJECT REVISION:
- TITLE
- DOCUMENT REVISION:
- DESIGN ITEM:
- BOM:
- FAB DWG:
- PCB DWG:
- ASSY DWG:
- SCALE:
- A3
- SIZE
- CAGE CODE
- FILE NAME
- DWG NO.
- SHEET
- OF
- REV

### Library data of the parts
C3-C7 = CMP-2010-01264-2: as C8 on sheet Mux side B (5-8); Mount: Surface Mount; Dielectric: X5R; Width: 0.012inch; Tolerance: 10%; Radiation Hardening: No; Voltage Rating: 10V; REACH SVHC: No SVHC; Height: 0.3mm; Max Operating Temperature: 85°C; Voltage Rating (DC): 10V; Thickness: 0.013inch; Termination: SMD/SMT; Lead Free: Lead Free; Package Quantity: 1; Case/Package: 0201; Min Operating Temperature: -55°C; Weight: 6E-06oz; Length: 0.6mm; Case Code (Imperial): 0201; Depth: 0.3mm; Voltage: 10V; Packaging: Tape and Reel; Case Code (Metric): 0603
R1-R60 = CMP-04015-056270-1: as R61 on sheet Mux side B (5-8)
U1-U5 = CMP-04892-000038-1: as U11 on sheet Mux side B (5-8); Width: 5.3mm; Case/Package: SSOP; Max Operating Temperature: 125°C; Mount: Surface Mount; Min Operating Temperature: -55°C; REACH SVHC: No SVHC; Contact Plating: Gold; Max Output Current: 25mA; Weight: 0.006081oz; Height: 1.95mm; Package Quantity: 2000; Length: 8.2mm; Lead Free: Lead Free; Operating Supply Current: 8uA; Packaging: Tape and Reel; Series: 74HC; Low Level Output Current: 25mA; Number of Outputs: 1; Termination: SMD/SMT; Number of Inputs: 16; Number of Bits: 16; Radiation Hardening: No; Number of Pins: 24
J1-J5 = 348250240: Package: None; Price: None; Value: *; MP: 348250240; Availability: Unavailable

## Sheet power input.SchDoc
size 431 x 279 mm; SheetNumber: 4; SheetTotal: 5
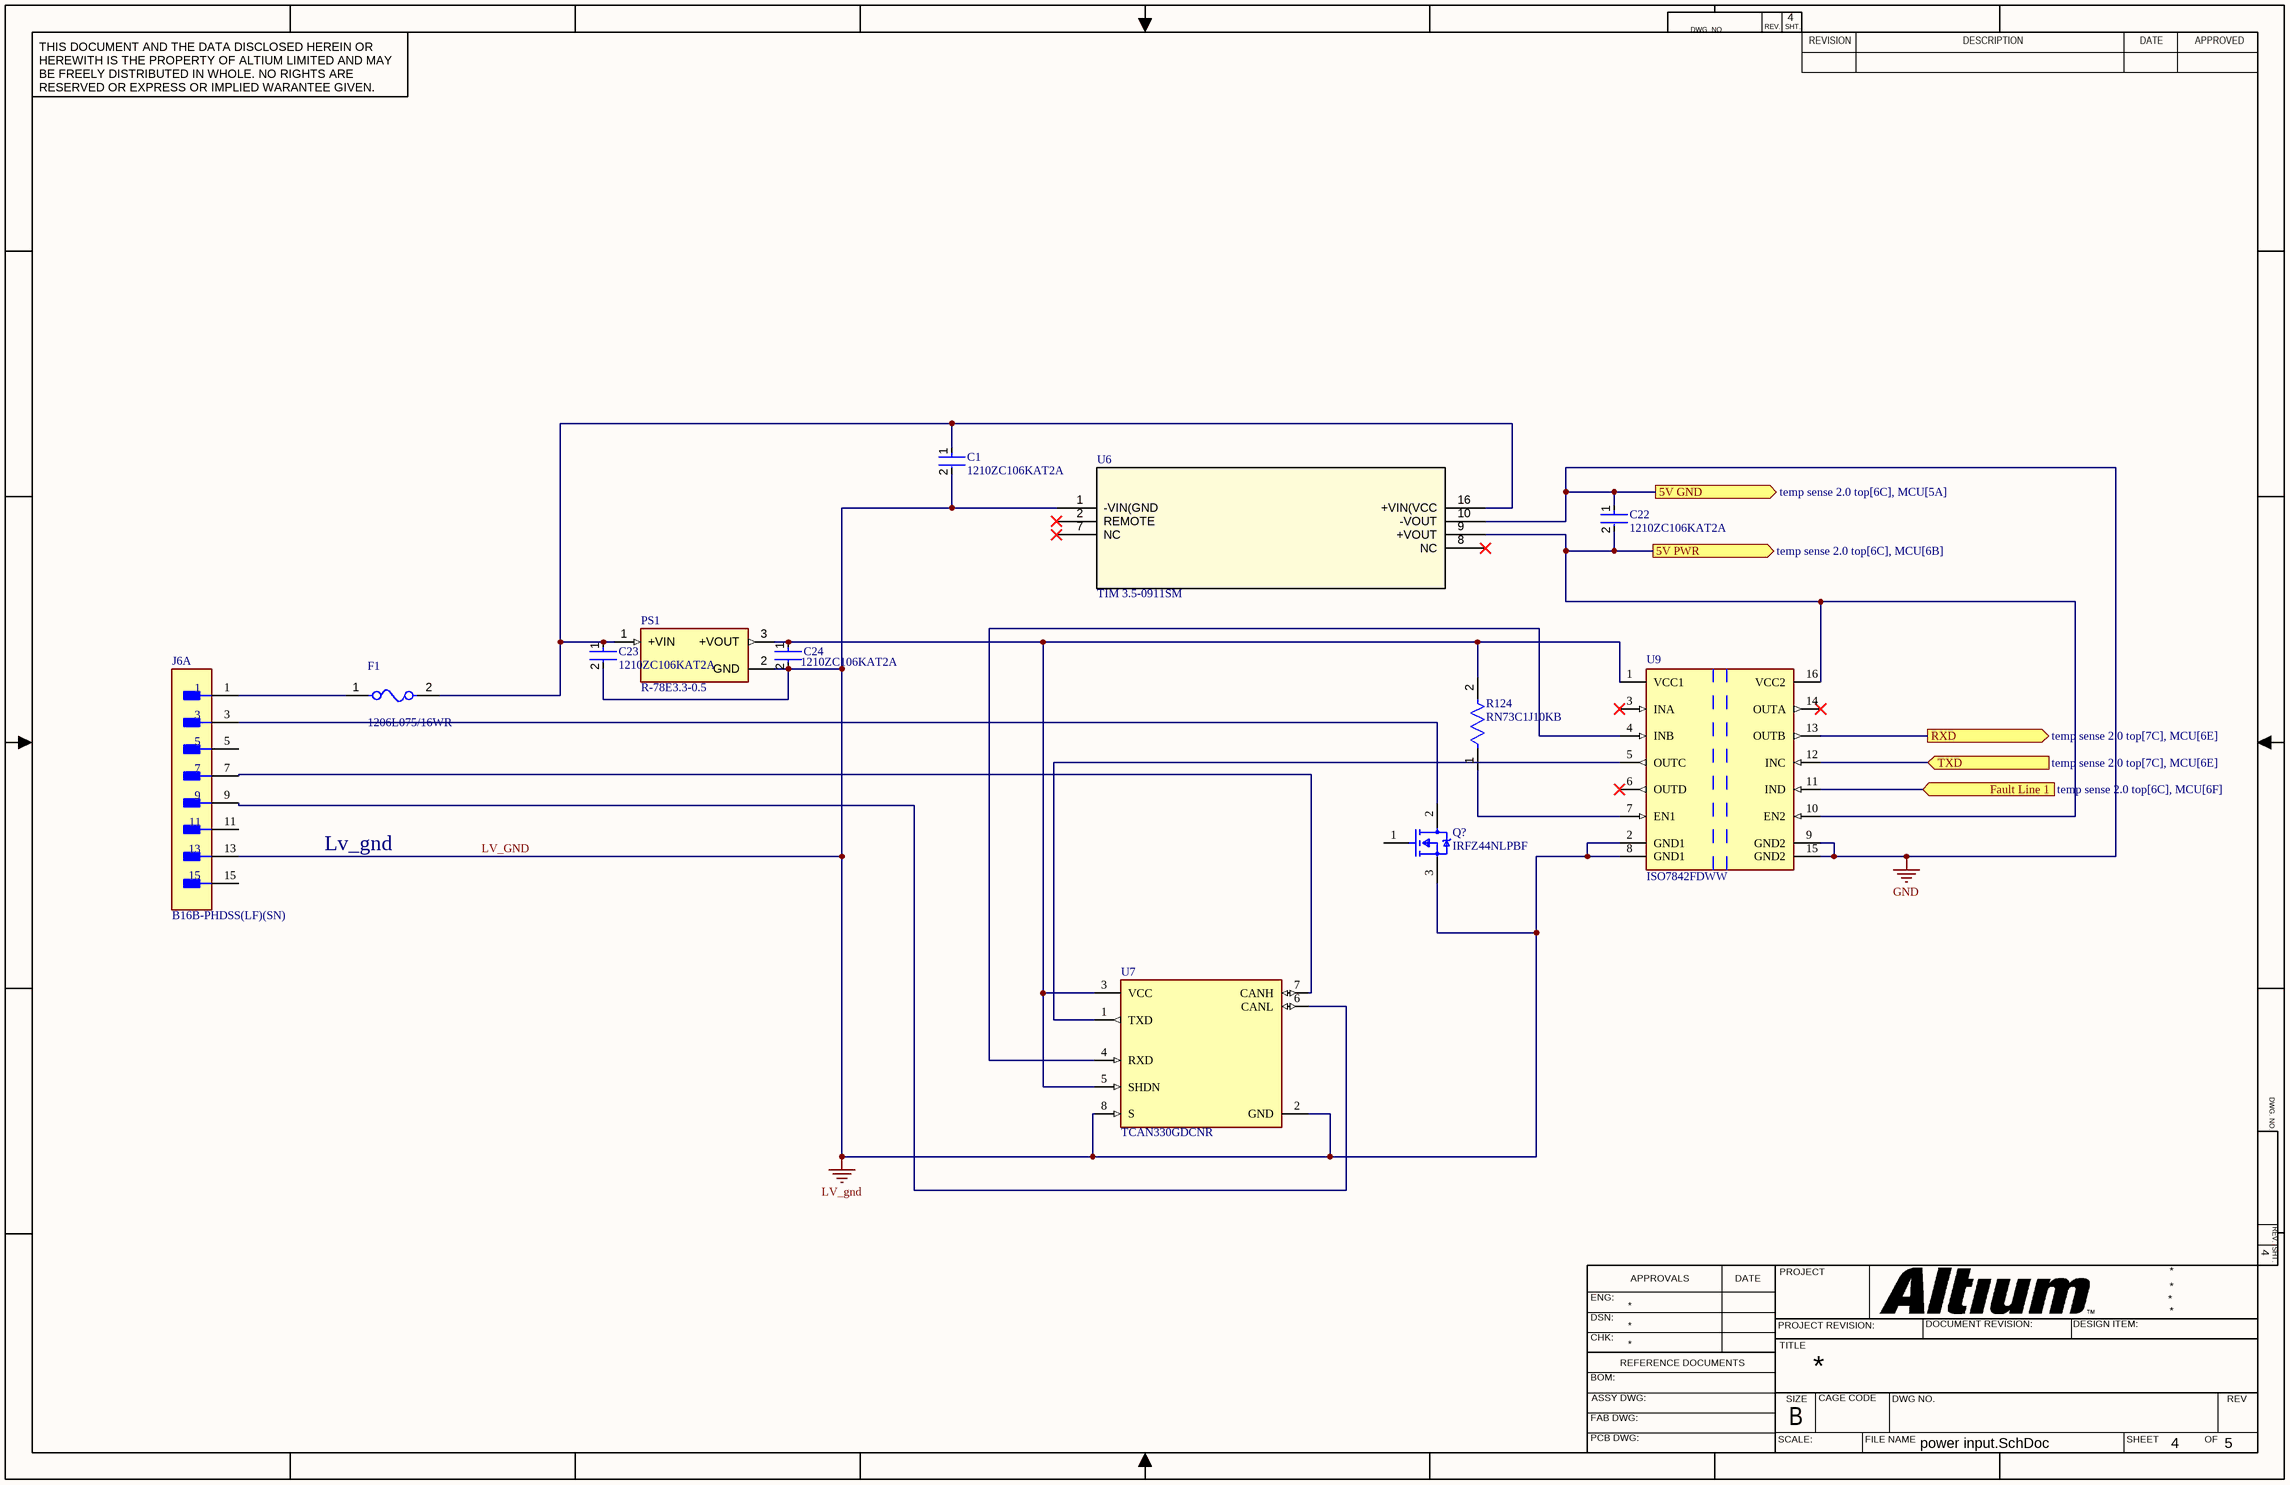
[diagram p16: power input.SchDoc]

### Parts
C1  1210ZC106KAT2A  [FP-1210-L_3_3_0_4-W_2_5_0-IPC_A]
C22  1210ZC106KAT2A  [FP-1210-L_3_3_0_4-W_2_5_0-IPC_A]
C23  1210ZC106KAT2A  [FP-1210-L_3_3_0_4-W_2_5_0-IPC_A]
C24  1210ZC106KAT2A  [FP-1210-L_3_3_0_4-W_2_5_0-IPC_A]
F1  1206L075/16WR  [FP-1206L-MFG]
J6  B16B-PHDSS(LF)(SN)  [FP-B16B-PHDSS_LF_SN-MFG]  (part A of 2)
PS1  R-78E3.3-0.5  [CONV_R-78E3.3-0.5]
Q?  IRFZ44NLPBF  [FP-PG-TO262-3-MFG]
R124  RN73C1J10KB  [FP-RN731J-MFG]
U6  TIM 3.5-0911SM  [TIM 3.5SM SINGLE_TRP]
U7  TCAN330GDCNR  [FP-DCN0008A-MFG]
U9  ISO7842FDWW  [FP-DWW0016A-MFG]

### Ports
5V GND (out, see temp sense 2.0 top[6C], MCU[5A]), 5V PWR (out, see temp sense 2.0 top[6C], MCU[6B]), Fault Line 1 (in, see temp sense 2.0 top[6C], MCU[6F]), RXD (out, see temp sense 2.0 top[7C], MCU[6E]), TXD (in, see temp sense 2.0 top[7C], MCU[6E])

### Nets
GND: C22.1 U6.10(-VOUT) U9.9(GND2) U9.15(GND2) ; port 5V GND
LV_GND: C1.2 C23.2 C24.2 J6.13 PS1.2(GND) Q?.3(S) U6.1(-VIN(GND) U7.2(GND) U7.8(S) U9.2(GND1) U9.8(GND1)
NetC1_1: C1.1 C23.1 F1.2 PS1.1(+VIN) U6.16(+VIN(VCC)
NetC22_2: C22.2 U6.9(+VOUT) U9.10(EN2) U9.16(VCC2) ; port 5V PWR
NetC24_1: C24.1 PS1.3(+VOUT) R124.2 U7.3(VCC) U7.5(SHDN) U9.1(VCC1)
NetF1_1: F1.1 J6.1
NetJ6_3: J6.3 Q?.2(D)
NetJ6_7: J6.7 U7.7(CANH)
NetJ6_9: J6.9 U7.6(CANL)
NetR124_1: R124.1 U9.7(EN1)
NetU7_1: U7.1(TXD) U9.5(OUTC)
NetU7_4: U7.4(RXD) U9.4(INB)
NetU9_11: U9.11(IND) ; port Fault Line 1
NetU9_12: U9.12(INC) ; port TXD
NetU9_13: U9.13(OUTB) ; port RXD

Not connected (* = marked no-connect by the designer): J6 5 11 15; Q? 1(G); U6 2(REMOTE)* 7(NC)* 8(NC)*; U9 3(INA)* 6(OUTD)* 14(OUTA)*

### Notes on the sheet
- Lv_gnd
- DWG. NO.
- REV.
- SHT.
- THIS DOCUMENT AND THE DATA DISCLOSED HEREIN OR HEREWITH IS THE PROPERTY OF ALTIUM LIMITED AND MAY BE FREELY DISTRIBUTED IN WHOLE. NO RIGHTS ARE RESERVED OR EXPRESS OR IMPLIED WARANTEE GIVEN.
- REVISION
- DESCRIPTION
- DATE
- APPROVED
- ENG:
- APPROVALS
- PROJECT
- DSN:
- CHK:
- REFERENCE DOCUMENTS
- PROJECT REVISION:
- TITLE
- DOCUMENT REVISION:
- DESIGN ITEM:
- BOM:
- FAB DWG:
- PCB DWG:
- ASSY DWG:
- SCALE:
- SIZE
- B
- CAGE CODE
- FILE NAME
- DWG NO.
- SHEET
- OF
- REV

### Library data of the parts
C1 C22-C24 = CMP-1038-02198-3: CAP CER 10UF 10V X7R 1210; Dissipation Factor: 5%; Tolerance: 10%; Capacitance: 10uF; Voltage Rating (DC): 10V; Case Code (Imperial): 1210; Termination: SMD/SMT; Min Operating Temperature: -55°C; Max Operating Temperature: 125°C; Voltage: 10V; RoHS Compliant: Yes; Lead Free: Lead Free; Construction: Flat; Case/Package: 1210; Dielectric: X7R; Width: 0.098inch; REACH SVHC: No SVHC; Mount: Surface Mount; Case Code (Metric): 3225; Depth: 2.5mm; Series: 1210; Voltage Rating: 10V; Packaging: Tape and Reel; Length: 3.2mm; Thickness: 0.11inch; Package Quantity: 1; Height: 2.79mm; Radiation Hardening: No
F1 = CMP-08606-000003-1: PTC RESET FUSE 16V 750MA 1206; Manufacturer: Littelfuse Inc; Hold Current: 0.75A; Resistance: 0.09-0.29Ω; Value: 0.09-0.29Ω; Trip Time: 0.2s; Current Rating: 100A; Trip Current: 1.5A; Device Class L2: PTC Resettable Fuses; RoHS: TRUE; Temperature: -40°C to +85°C; ComponentLink2URL: https://www.littelfuse.com/~/media/electronics/datasheets/resettable_ptcs/littelfuse_ptc_1206l_datasheet.pdf.pdf; Voltage Rating: 16V; Category: Fuse; Manufacturer Part Number: 1206L075/16WR; Lead Free: Yes; Digikey Description: PTC RESET FUSE 16V 750MA 1206; Temperature Range Low: -40°C; Temperature Range High: +85°C; Octopart: https://octopart.com/1206l075%2F16wr-littelfuse-28867102; Package: 1206L; Device Class L1: Circuit Protection; Height: 1.25mm; ComponentLink2Description: Datasheet; Automotive: No; Mouser Description: Resettable Fuses - PPTC 16V 0.75A 1206 PTC; Device Class L3: unset
J6 = CMP-17439-000399-1: CONN HEADER VERT 16POS 2MM; Max Current Rating: 3A; Voltage Rating: 250V; Row Spacing: 0.079inch; Number of Contacts: 16; Mated Stacking Heights: 8.8mm; Contact Resistance: 20mR; Gender: Male; Contact Finish - Mating: TIN; Contact Mating Length: 0.114inch; Current Rating: 3A; Connector Type: Header; Insulation Material: Nylon; Packaging: Bulk; Max Voltage Rating (AC): 250V; Depth: 5mm; Number of Rows: 2; Length: 17.9mm; Width: 5mm; Mount: Through Hole; Contact Material: Copper Alloy; Pitch: 2mm; Insulation Color: Natural; Lead Free: Lead Free; Housing Material: Polyamide; Min Operating Temperature: -25°C; Max Operating Temperature: 85°C; Contact Type: Male Pin; Fastening Type: Detent; Height: 9.5mm; Color: Natural; Contact Shape: Square; Housing Color: Beige; Series: PHD; Number of Positions: 16; Orientation: Straight; Flammability Rating: UL94 V-0; Termination: Solder; Contact Plating: Copper
PS1 = R-78E3.3-0.5: 0.5A DC/DC-Converter 'INNOLINE' SIP3 reg; MF: Recom Power; Check_prices: https://www.snapeda.com/parts/R-78E3.3-0.5/Recom+Power/view-part/?ref=eda; Value: *; MP: R-78E3.3-0.5; Purchase-URL: https://pricing.snapeda.com/search/part/R-78E3.3-0.5/?ref=eda; SnapEDA_Link: https://www.snapeda.com/parts/R-78E3.3-0.5/Recom+Power/view-part/?ref=snap; Package: SIP-3 Recom Power; Digi-Key_Part_Number: 945-1661-5-ND
Q? = CMP-00196-65874408-1: IRFZ44NLPBF Single N-Channel 55 V 17.5 mOhm 63 nC HEXFET® Power Mosfet - TO-262; Resistance: 17.5MΩ; Turn-On Delay Time: 12ns; Drain to Source Breakdown Voltage: 55V; Threshold Voltage: 4V; Rise Time: 60ns; Input Capacitance: 1.47nF; Power Dissipation: 110W; Max Junction Temperature (Tj): 175°C; Gate to Source Voltage (Vgs): 20V; Number of Channels: 1; Fall Time: 45ns; Max Power Dissipation: 3.8W; Continuous Drain Current (ID): 49A; Turn-Off Delay Time: 44ns; Case/Package: TO-262; Lifecycle Status: Production; Packaging: Bulk; RoHS: Compliant; Radiation Hardening: No; Height: 9.65mm; Voltage Rating (DC): 55V; On-State Resistance: 17.5mΩ; Width: 4.826mm; Mount: Through Hole; Max Operating Temperature: 175°C; Schedule B: 8541290080, 8541290080; Termination: Through Hole; Dual Supply Voltage: 55V; Package Quantity: 1000; Min Operating Temperature: -55°C; Lead Free: Contains Lead, Lead Free; Drain to Source Voltage (Vdss): 55V; Element Configuration: Single; Length: 10.668mm; Rds On Max: 17.5mΩ; Number of Pins: 3; Current Rating: 49A; REACH SVHC: No SVHC; Drain to Source Resistance: 17.5mΩ; NexarPartId: 65874408; Number of Elements: 1; Nominal Vgs: 4V
R124 = CMP-03211-006130-1: Thin Film Resistors RN 0603 10KΩ 0.1% 10ppm/°C; Manufacturer: TE Connectivity; Voltage Rating: 50V; Power Rating: 0.063W; Octopart: https://octopart.com/rn73c1j10kb-te+connectivity-47108040; RoHS: TRUE; Value: 10KΩ; Device Class L1: Passive Components; Manufacturer Part Number: RN73C1J10KB; ComponentLink2URL: https://www.te.com/commerce/DocumentDelivery/DDEController?Action=showdoc&DocId=Data+Sheet%7F1773270%7FP%7Fpdf%7FEnglish%7FENG_DS_1773270_P.pdf%7F9-1614352-9; Resistance: 10KΩ; Temperature Coefficient: 10ppm/°C; Device Class L2: Resistors; Temperature Range High: +155°C; Temperature: -55°C to +155°C; Series: RN73; Height: 0.55mm; Package: RN731J; octopart_url: https://octopart.com/rn73c1j10kb-te+connectivity-47108040; ComponentLink2Description: Datasheet; Temperature Range Low: -55°C; Composition: Thin Film; Ipc Land Pattern Name: RESC15580X45; Automotive: No; Lead Free: Yes; Device Class L3: Chip SMD Resistors; Category: Res; Tolerance: 0.1%
U6 = CMP-01539-89931857-1: TIM 3.5-0911SM 3.5 Watt DC/DC converter, medical, 4: 1 input, 5000 VAC I/O-isolation (2 x MOPP), low leakage current, encapsulated,...; Output Power: 3.5W; Number of Outputs: 1; NexarPartId: 89931857; Height: 10.5mm; Width: 14.4mm; RoHS: Compliant
U7 = CMP-04872-000178-1: IC TRANSCEIVER 1/1 SOT23-8; Data Rate: 1Mbps; Packaging: Tape and Reel; Min Operating Temperature: -40°C; Max Operating Temperature: 125°C; RoHS Compliant: Yes; Lead Free: Lead Free; Case/Package: SOT-23-8; Mount: Surface Mount
U9 = CMP-04872-000209-1: DGTL ISO 5700VRMS 4CH GP 16SOIC; Min Supply Voltage: 2.25V; Pulse Width Distortion (PWD): 4.1ns; Channel Type: Unidirectional; Number of Channels: 4; Max Supply Voltage: 5.5V; Isolated Power: No; Propagation Delay: 16ns; Data Rate: 100Mbps; Type: General Purpose; Packaging: Rail/Tube; REACH SVHC: No SVHC; Number of Pins: 16; Max Operating Temperature: 125°C; Case/Package: SOIC; RoHS Compliant: Yes; Min Operating Temperature: -55°C; Lead Free: Lead Free

## Nets that join several sheets
GND: Mux side B (5-8) (75 pins), mux side A (1-4) (75 pins), power input (C22.1 U6.10 U9.9 U9.15)
NetU1_10: Mux side B (5-8) (5 pins), mux side A (1-4) (5 pins)
NetU1_11: Mux side B (5-8) (5 pins), mux side A (1-4) (5 pins)
NetU1_13: Mux side B (5-8) (5 pins), mux side A (1-4) (5 pins)
NetU1_14: Mux side B (5-8) (5 pins), mux side A (1-4) (5 pins)